# EAGLE design firestorm_1.3 (EAGLE 6.5.0)

## Sheet 1 of 2: Firestorm
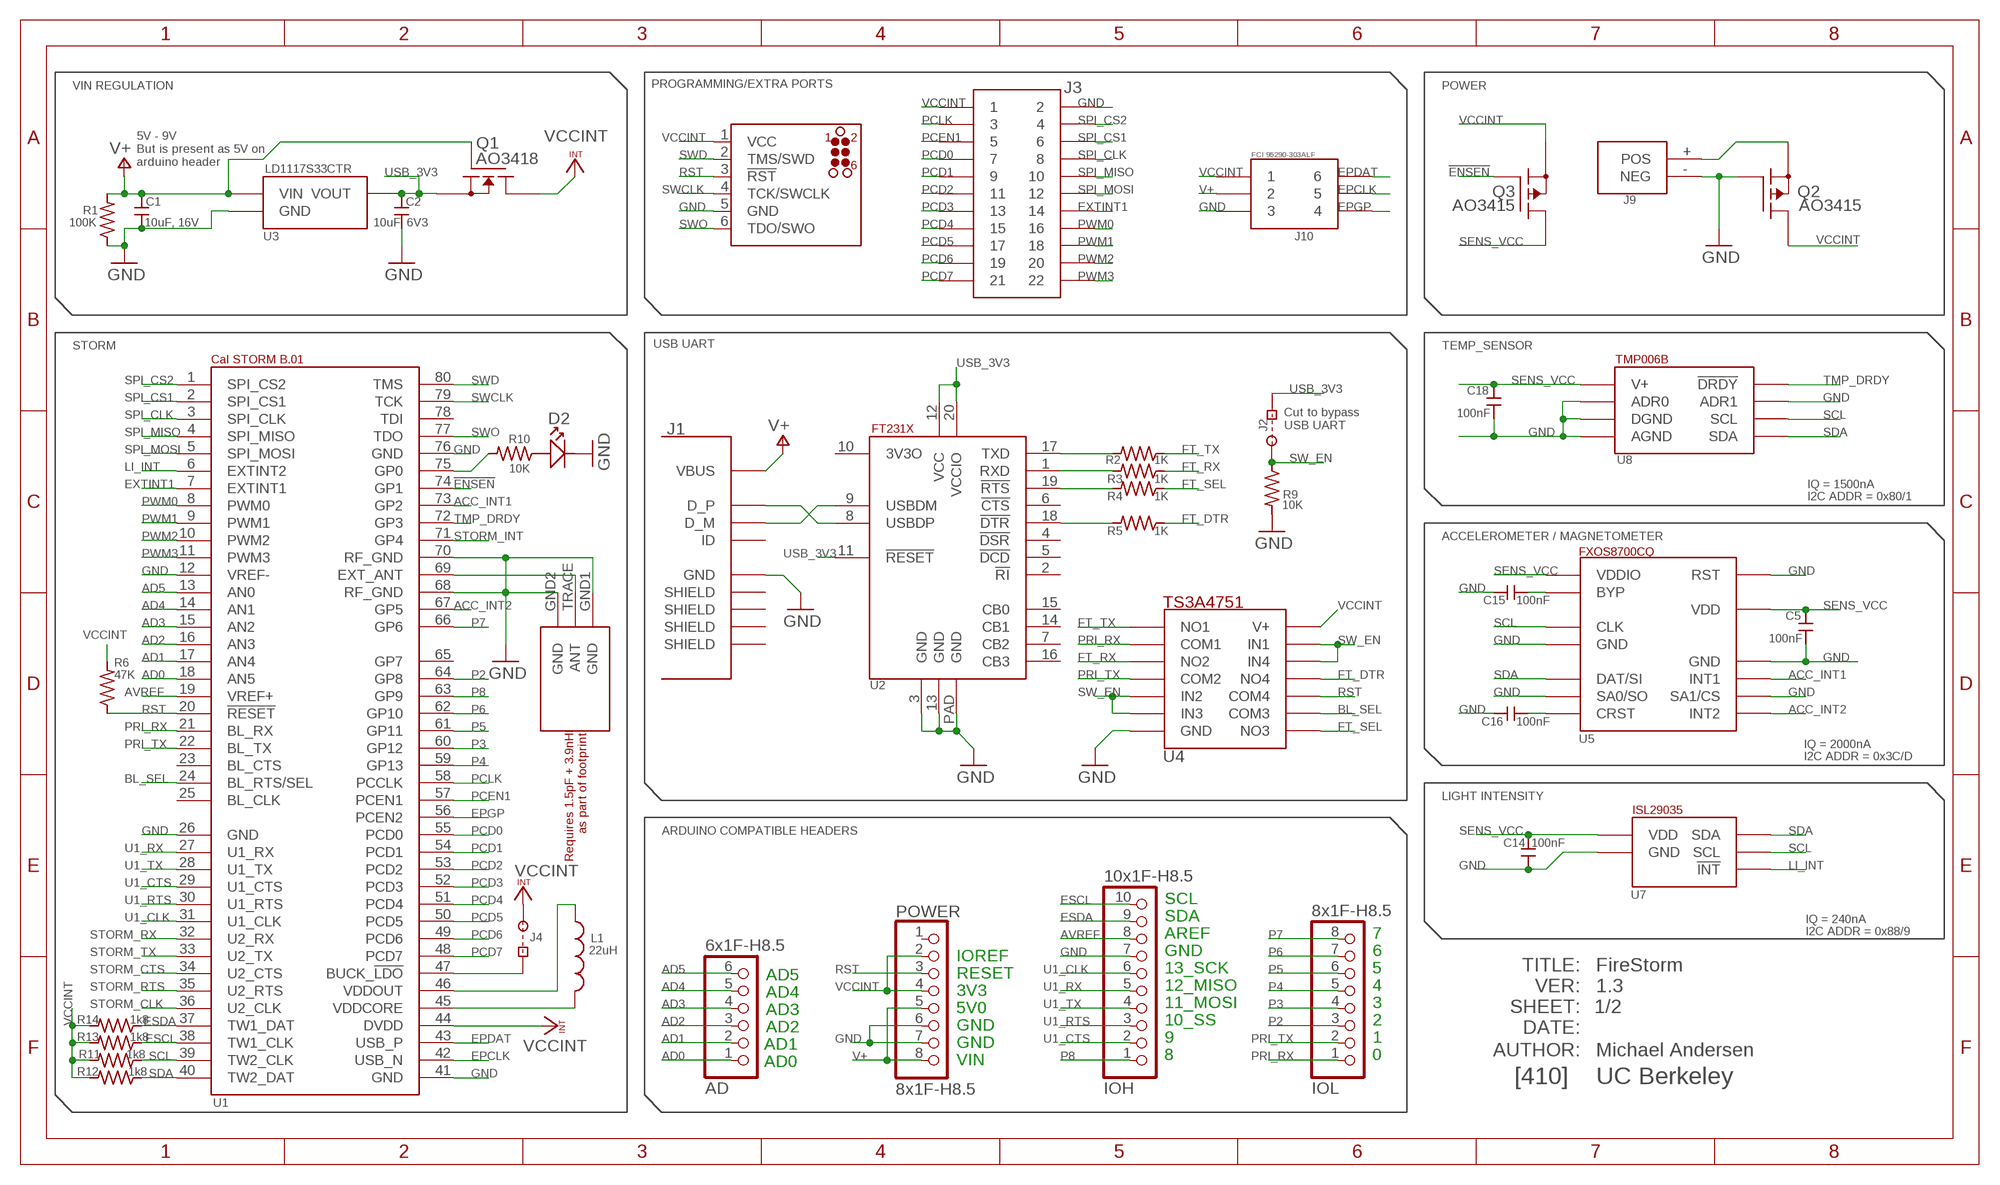
[diagram p0: schematic, sheet 1]

### Parts
AD  6x1F-H8.5  PINHD-1X6  [1X06]
C1  10uF, 16V  0805_CAPACITOR  [0805]
C2  10uF, 6V3  0603_CAPACITOR  [C0603]
C5  100nF  0603_CAPACITOR0402  [C0402]
C14  100nF  0603_CAPACITOR0402  [C0402]
C15  100nF  0603_CAPACITOR0402  [C0402]
C16  100nF  0603_CAPACITOR0402  [C0402]
C18  100nF  0603_CAPACITOR0402  [C0402]
D2  STATLED  [LINE_0805]
IOH  10x1F-H8.5  PINHD-1X10_ARD  [1X10]
IOL  8x1F-H8.5  PINHD-1X8  [1X08]
J1  USBSMT  [USB_SMT]
J2  CUTJ  [CUT]
J3  22WIDC  [22WIDC]
J4  CUTJBOT  [CUT2]
J8  JLINK_CONNECT  [TC2030-MCP-NL]
J9  BATCON  [BATCON]
J10  THRUB_POWER  [POWER_MODULE]
L1  22uH  SRN4018  [SRN4018]
POWER  8x1F-H8.5  PINHD-1X8  [1X08]
Q1  AO3418  [SOT23]
Q2  AO3415  [SOT23]
Q3  AO3415  [SOT23]
R1  100K  0603_RESISTOR0402  [C0402]
R2  1K  0603_RESISTOR0402  [C0402]
R3  1K  0603_RESISTOR0402  [C0402]
R4  1K  0603_RESISTOR0402  [C0402]
R5  1K  0603_RESISTOR0402  [C0402]
R6  47K  0603_RESISTOR0402  [C0402]
R9  10K  0603_RESISTOR0402  [C0402]
R10  10K  0603_RESISTOR0402  [C0402]
R11  1k8  0603_RESISTOR0402  [C0402]
R12  1k8  0603_RESISTOR0402  [C0402]
R13  1k8  0603_RESISTOR0402  [C0402]
R14  1k8  0603_RESISTOR0402  [C0402]
U1  STORM_B.01  [STORM_LANDING]
U2  FT231X  [QFN20L]
U3  LD1117S33CTR_3V3_REG  [SOT223]
U4  QUAD_SWITCH_TS3A4751  [TSSOP14]
U5  ACCEL_FXOS8700CQ  [TQFN16]
U7  ISL29035  [ISL29035]
U8  TMP006B  [TMP006]
U$2  JOHANSON  [JOHANSON_ANTENNA]

### Nets
!ENSEN!: Q3.1(G) U1.74(GP1)
ACC_INT1: U1.73(GP2) U5.P11(INT1)
ACC_INT2: U1.67(GP5) U5.P9(INT2)
ACCEL_BYP: C15.1 U5.P2(BYP)
AD0: AD.1 U1.18(AN5)
AD1: AD.2 U1.17(AN4)
AD2: AD.3 U1.16(AN3)
AD3: AD.4 U1.15(AN2)
AD4: AD.5 U1.14(AN1)
AD5: AD.6 U1.13(AN0)
AVREF: IOH.8 U1.19(VREF+)
BL_SEL: U1.24(BL_RTS/SEL) U4.9(COM3)
EPCLK: J10.5 U1.42(USB_N)
EPDAT: J10.6 U1.43(USB_P)
EPGP: J10.4 U1.56(PCEN2)
ESCL: IOH.10 R13.2 U1.38(TW1_CLK)
ESDA: IOH.9 R14.2 U1.37(TW1_DAT)
EXTINT1: J3.14 U1.7(EXTINT1)
FT_DTR: R5.2 U4.11(NO4)
FT_RX: R3.2 U4.3(NO2)
FT_SEL: R4.2 U4.8(NO3)
FT_TX: R2.2 U4.1(NO1)
GND: C1.1 C2.1 C5.1 C14.1 C15.2 C16.2 C18.1 D2.LINE(-) IOH.7 J1.5GND(GND) J3.2 J8.5(GND) J9.-(NEG) J10.3 POWER.6 POWER.7 Q2.1(G) R1.2 R9.1 U1.12(VREF-) U1.26(GND) U1.41(GND) U1.68(RF_GND) U1.70(RF_GND) U1.76(GND) U2.3(GND) U2.13(GND) U2.PAD(GND) U3.1(GND) U4.7(GND) U5.P5(GND) U5.P7(SA0/SO) U5.P10(SA1/CS) U5.P12(GND) U5.P16(RST) U7.2(GND) U8.A1(DGND) U8.A2(AGND) U8.B1(ADR1) U8.C1(ADR0) U$2.GND1(GND) U$2.GND2(GND) ; also sheet 2
LI_INT: U1.6(EXTINT2) U7.4(!INT!)
N$1: J1.3D+(D_P) U2.8(USBDP)
N$2: J1.2D-(D_M) U2.9(USBDM)
N$3: R2.1 U2.17(TXD)
N$4: R3.1 U2.1(RXD)
N$7: L1.P$2 U1.45(VDDCORE)
N$11: U1.69(EXT_ANT) U$2.TRACE(ANT)
N$15: C16.1 U5.P8(CRST)
N$17: R4.1 U2.19(!RTS!)
N$18: R5.1 U2.18(!DTR!)
N$20: L1.P$1 U1.46(VDDOUT)
N$21: R10.1 U1.75(GP0)
N$22: J4.SQ U1.47(BUCK_!LDO!)
N$24: D2.NOLINE(+) R10.2
N$26: J9.+(POS) Q2.2(S)
P2: IOL.3 U1.64(GP8)
P3: IOL.4 U1.60(GP12)
P4: IOL.5 U1.59(GP13)
P5: IOL.6 U1.61(GP11)
P6: IOL.7 U1.62(GP10)
P7: IOL.8 U1.66(GP6)
P8: IOH.1 U1.63(GP9)
PCD0: J3.7 U1.55(PCD0)
PCD1: J3.9 U1.54(PCD1)
PCD2: J3.11 U1.53(PCD2)
PCD3: J3.13 U1.52(PCD3)
PCD4: J3.15 U1.51(PCD4)
PCD5: J3.17 U1.50(PCD5)
PCD6: J3.19 U1.49(PCD6)
PCD7: J3.21 U1.48(PCD7)
PCEN1: J3.5 U1.57(PCEN1)
PCLK: J3.3 U1.58(PCCLK)
PRI_RX: IOL.1 U1.21(BL_RX) U4.2(COM1)
PRI_TX: IOL.2 U1.22(BL_TX) U4.4(COM2)
PWM0: J3.16 U1.8(PWM0)
PWM1: J3.18 U1.9(PWM1)
PWM2: J3.20 U1.10(PWM2)
PWM3: J3.22 U1.11(PWM3)
RST: J8.3(!RST!) POWER.3 R6.2 U1.20(!RESET!) U4.10(COM4)
SCL: R11.2 U1.39(TW2_CLK) U5.P4(CLK) U7.5(SCL) U8.B3(SCL) ; also sheet 2
SDA: R12.2 U1.40(TW2_DAT) U5.P6(DAT/SI) U7.6(SDA) U8.C3(SDA) ; also sheet 2
SENS_VCC: C5.2 C14.2 C18.2 Q3.3(D) U5.P1(VDDIO) U5.P14(VDD) U7.1(VDD) U8.A3(V+)
SPI_CLK: J3.8 U1.3(SPI_CLK)
SPI_CS1: J3.6 U1.2(SPI_CS1)
SPI_CS2: J3.4 U1.1(SPI_CS2)
SPI_MISO: J3.10 U1.4(SPI_MISO)
SPI_MOSI: J3.12 U1.5(SPI_MOSI)
STORM_CLK: U1.36(U2_CLK) ; also sheet 2
STORM_CTS: U1.34(U2_CTS) ; also sheet 2
STORM_INT: U1.71(GP4) ; also sheet 2
STORM_RTS: U1.35(U2_RTS) ; also sheet 2
STORM_RX: U1.32(U2_RX) ; also sheet 2
STORM_TX: U1.33(U2_TX) ; also sheet 2
SW_EN: J2.R R9.2 U4.5(IN2) U4.6(IN3) U4.12(IN4) U4.13(IN1)
SWCLK: J8.4(TCK/SWCLK) U1.79(TCK)
SWD: J8.2(TMS/SWD) U1.80(TMS)
SWO: J8.6(TDO/SWO) U1.77(TDO)
TMP_DRDY: U1.72(GP3) U8.C2(!DRDY!)
U1_CLK: IOH.6 U1.31(U1_CLK)
U1_CTS: IOH.2 U1.29(U1_CTS)
U1_RTS: IOH.3 U1.30(U1_RTS)
U1_RX: IOH.5 U1.27(U1_RX)
U1_TX: IOH.4 U1.28(U1_TX)
USB_3V3: C2.2 J2.SQ Q1.2(S) U2.11(!RESET!) U2.12(VCC) U2.20(VCCIO) U3.2(VOUT)
V+: C1.2 J1.1VBUS(VBUS) J10.2 POWER.5 POWER.8 Q1.1(G) R1.1 U3.3(VIN) ; also sheet 2
VCCINT: J3.1 J4.R J8.1(VCC) J10.1 POWER.2 POWER.4 Q1.3(D) Q2.3(D) Q3.2(S) R6.1 R11.1 R12.1 R13.1 R14.1 U1.44(DVDD) U4.14(V+) ; also sheet 2
Unconnected: J1.4ID(ID) J1.SHIELD@1(SHIELD) J1.SHIELD@2(SHIELD) J1.SHIELD@3(SHIELD) J1.SHIELD@4(SHIELD) POWER.1 U1.23(BL_CTS) U1.25(BL_CLK) U1.65(GP7) U1.78(TDI) U2.2(!RI!) U2.4(!DSR!) U2.5(!DCD!) U2.6(!CTS!) U2.7(CB2) U2.10(3V3O) U2.14(CB1) U2.15(CB0) U2.16(CB3)

### Notes on the sheet
- VIN REGULATION | PROGRAMMING/EXTRA PORTS | POWER
- 5V - 9V
- But is present as 5V on
  arduino header
- STORM | USB UART | TEMP_SENSOR
- Cut to bypass
  USB UART
- IQ = 1500nA
- I2C ADDR = 0x80/1
- ACCELEROMETER / MAGNETOMETER
- IQ = 2000nA
- I2C ADDR = 0x3C/D
- LIGHT INTENSITY
- ARDUINO COMPATIBLE HEADERS
- SCL
- SDA | IQ = 240nA
- AREF | 7 | I2C ADDR = 0x88/9
- GND | 6 | TITLE:
- IOREF
- 13_SCK | 5 | FireStorm
- AD5 | RESET | VER:
- 12_MISO | 4 | 1.3
- AD4 | 3V3 | SHEET:
- 11_MOSI | 3
- AD3 | 5V0
- DATE:
- 10_SS | 2
- AD2 | GND
- 9 | 1 | AUTHOR:
- AD1 | GND
- 8 | 0 | Michael Andersen
- AD0 | VIN
- [410] | UC Berkeley

## Sheet 2 of 2
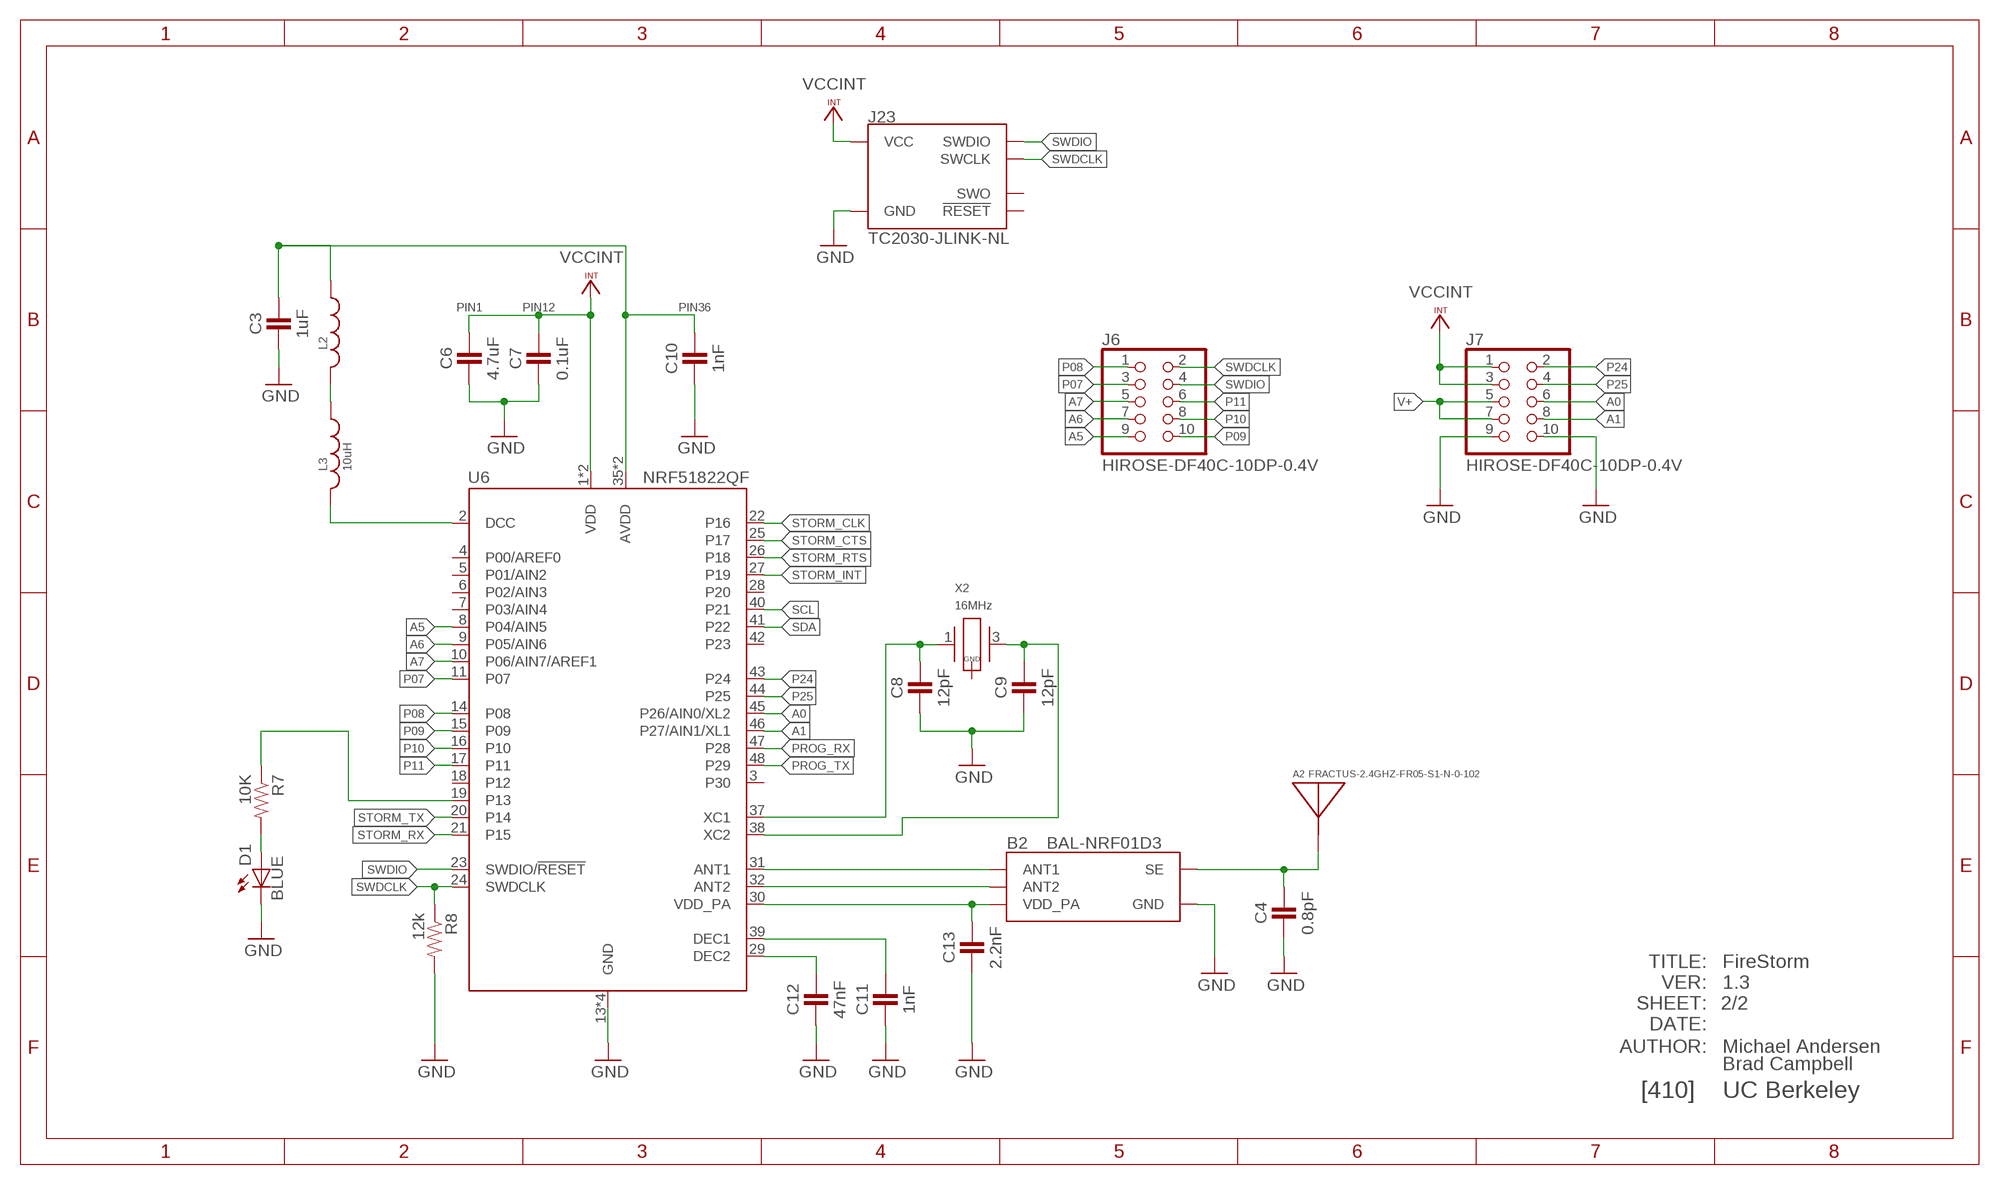
[diagram p1: schematic, sheet 2]

### Parts
A2  FRACTUS-2.4GHZ-FR05-S1-N-0-102  [FRACTUS-ANTENNA-FR05-S1-N-0-102]
B2  BAL-NRF01D3  [BAL-NRF01D3]
C3  1uF  CAPACITOR  [0402_CAP]
C4  0.8pF  CAPACITOR  [0402_CAP]
C6  4.7uF  CAPACITOR  [0402_CAP]
C7  0.1uF  CAPACITOR  [0402_CAP]
C8  12pF  CAPACITOR  [0402_CAP]
C9  12pF  CAPACITOR  [0402_CAP]
C10  1nF  CAPACITOR  [0402_CAP]
C11  1nF  CAPACITOR  [0402_CAP]
C12  47nF  CAPACITOR  [0402_CAP]
C13  2.2nF  CAPACITOR  [0402_CAP]
D1  BLUE  LED0603  [LED-0603]
J6  HIROSE-DF40C-10DP-0.4V  [2X5/SMD/0.4MM]
J7  HIROSE-DF40C-10DP-0.4V  [2X5/SMD/0.4MM]
J23  TC2030-JLINK-NL  [TC2030-IDC-NL]
L2  INDUCTOR0402  [0402_CAP]
L3  10uH  INDUCTOR0603  [0603_CAP]
R7  10K  RESISTOR  [0402_RES]
R8  12k  RESISTOR  [0402_RES]
U6  NRF51822QF  [QFN-48-6MM]
X2  16MHz  TXC-8Y  [TXC-8Y]

### Nets
A0: J7.6 U6.45(P26/AIN0/XL2)
A1: J7.8 U6.46(P27/AIN1/XL1)
A5: J6.9 U6.8(P04/AIN5)
A6: J6.7 U6.9(P05/AIN6)
A7: J6.5 U6.10(P06/AIN7/AREF1)
AVDD: C3.1 C10.1 L2.1 U6.35(AVDD) U6.36(AVDD)
DCC: L3.2 U6.2(DCC)
GND: B2.GND C3.2 C4.2 C6.2 C7.2 C8.2 C9.2 C10.2 C11.2 C12.2 C13.2 D1.C J7.9 J7.10 J23.5(GND) R8.2 U6.13(GND) U6.33(GND) U6.34(GND) U6.GND ; also sheet 1
N$5: B2.ANT1 U6.31(ANT1)
N$8: B2.ANT2 U6.32(ANT2)
N$9: A2.1(ANTENNA) B2.SE C4.1
N$10: C9.1 U6.38(XC2) X2.3
N$12: C11.1 U6.39(DEC1)
N$13: R7.1 U6.19(P13)
N$14: L2.2 L3.1
N$16: C8.1 U6.37(XC1) X2.1
N$19: C12.1 U6.29(DEC2)
N$23: D1.A R7.2
P07: J6.3 U6.11(P07)
P08: J6.1 U6.14(P08)
P09: J6.10 U6.15(P09)
P10: J6.8 U6.16(P10)
P11: J6.6 U6.17(P11)
P24: J7.2 U6.43(P24)
P25: J7.4 U6.44(P25)
PROG_RX: U6.47(P28)
PROG_TX: U6.48(P29)
SCL: U6.40(P21) ; also sheet 1
SDA: U6.41(P22) ; also sheet 1
STORM_CLK: U6.22(P16) ; also sheet 1
STORM_CTS: U6.25(P17) ; also sheet 1
STORM_INT: U6.27(P19) ; also sheet 1
STORM_RTS: U6.26(P18) ; also sheet 1
STORM_RX: U6.21(P15) ; also sheet 1
STORM_TX: U6.20(P14) ; also sheet 1
SWDCLK: J6.2 J23.4(SWCLK) R8.1 U6.24(SWDCLK)
SWDIO: J6.4 J23.2(SWDIO) U6.23(SWDIO/!RESET)
V+: J7.5 J7.7 ; also sheet 1
VCCINT: C6.1 C7.1 J7.1 J7.3 J23.1(VCC) U6.1(VDD) U6.12(VDD) ; also sheet 1
VDD_PA: B2.VCC(VDD_PA) C13.1 U6.30(VDD_PA)
Unconnected: J23.3(!RESET) J23.6(SWO) U6.3(P30) U6.4(P00/AREF0) U6.5(P01/AIN2) U6.6(P02/AIN3) U6.7(P03/AIN4) U6.18(P12) U6.28(P20) U6.42(P23) X2.2(GND) X2.4(GND)

### Notes on the sheet
- PIN1 | PIN12 | PIN36
- TITLE:
- FireStorm
- VER:
- 1.3
- SHEET:
- DATE:
- AUTHOR:
- Michael Andersen
- Brad Campbell
- [410] | UC Berkeley

## Library data of the parts
A2 = chips:FRACTUS-2.4GHZ-FR05-S1-N-0-102: Fractus Compact Reach XtendTM chip antenna is engineered specifically for Bluetooth, WLAN 802.11 b/g/n and other wireless devices operating at the ISM 2.4 GHz band. Compact Reach Xtend combines small form factor size and high performance to improve the functionality of your wireless devices.; RICHARDSON_RFPD: FR05-S1-N-0102B
AD = SmartPrj:PINHD-1X6: PIN HEADER
B2 = chips:BAL-NRF01D3: 50 ohm nominal input / conjugate match balun to nRF51422-QFAA, nRF24LE1, nRF51822-QFAA/AB, with integrated harmonic filter; DIGIKEY: 497-13637-1-ND; MOUSER: 511-BAL-NRF01D3
C1 = storm:0805_CAPACITOR
C2 C5 C14-C16 C18 = storm:0603_CAPACITOR
C3 = passives:CAPACITOR: 0402 Capacitor; DIGIKEY: 1276-1513-1-ND
C4 C13 = passives:CAPACITOR: 0402 Capacitor; DIGIKEY: 490-5419-1-ND
C6 = passives:CAPACITOR: 0402 Capacitor; DIGIKEY: 445-5947-1-ND
C7 = passives:CAPACITOR: 0402 Capacitor; DIGIKEY: 445-4952-1-ND
C8 C9 = passives:CAPACITOR: 0402 Capacitor; DIGIKEY: 490-6197-1-ND
C10 C11 = passives:CAPACITOR: 0402 Capacitor; DIGIKEY: 490-1303-1-ND
C12 = passives:CAPACITOR: 0402 Capacitor; DIGIKEY: 445-1264-1-ND
D1 = SparkFun-LED:LED: LEDs Standard schematic elements and footprints for 5mm, 3mm, 1206, and 0603 sized LEDs. 5mm - Spark Fun Electronics SKU : COM-00529 (and others)
D2 = storm:STATLED
IOH = SmartPrj:PINHD-1X10_ARD: PIN HEADER
IOL POWER = SmartPrj:PINHD-1X8: PIN HEADER
J1 = storm:USB
J2 J4 = storm:CUTJ
J3 = storm:22WIDC
J6 J7 = headers:HIROSE-DF40C-10DP-0.4V: DF40 Series Header - 0.4MM Pitch; DIGIKEY: H11616CT-ND; MOUSER: 798-DF40C10DP0.4V51; NEWARK: 68X2585
J8 = storm:JLINK_CONNECT
J9 = storm:BATCON
J10 = storm:THRUB_POWER
J23 = connector:TC2030-JLINK
L1 = storm:SRN4018
L2 = passives:INDUCTOR; DIGIKEY: 587-1521-1-ND
L3 = passives:INDUCTOR; DIGIKEY: 490-4025-1-ND
Q1 = storm:AO3418
Q2 Q3 = storm:AO3415
R1-R6 R9-R14 = storm:0603_RESISTOR
R7 = passives:RESISTOR: Resistor Basic schematic elements and footprints for 0603, 1206, and PTH resistors.; DIGIKEY: RHM470CECT-ND
R8 = passives:RESISTOR: Resistor Basic schematic elements and footprints for 0603, 1206, and PTH resistors.; DIGIKEY: RHM12.0KCDCT-ND
U1 = storm:STORM_B.01
U2 = storm:FT231X
U3 = storm:LD1117S33CTR_3V3_REG
U4 = storm:QUAD_SWITCH_TS3A4751
U5 = storm:ACCEL_FXOS8700CQ
U6 = chips:NRF51822: Multiprotocol Bluetooth® 4.0 low energy/2.4 GHz RF SoC; DIGIKEY: 1490-1032-1-ND; MOUSER: 949-NRF51822-QFAB-R7
U7 = storm:ISL29035
U8 = storm:TMP006B
U$2 = storm:JOHANSON
X2 = crystals:TXC-8Y: 2mmx1.6mm SMD Crystal; DIGIKEY: 887-2003-1-ND

## Net classes
0 default: width 0.203 mm
1 power: width 0.203 mm
2 gnd: width 0.203 mm
3 usbvcc: width 0.203 mm
4 aref: width 0.203 mm

## Board
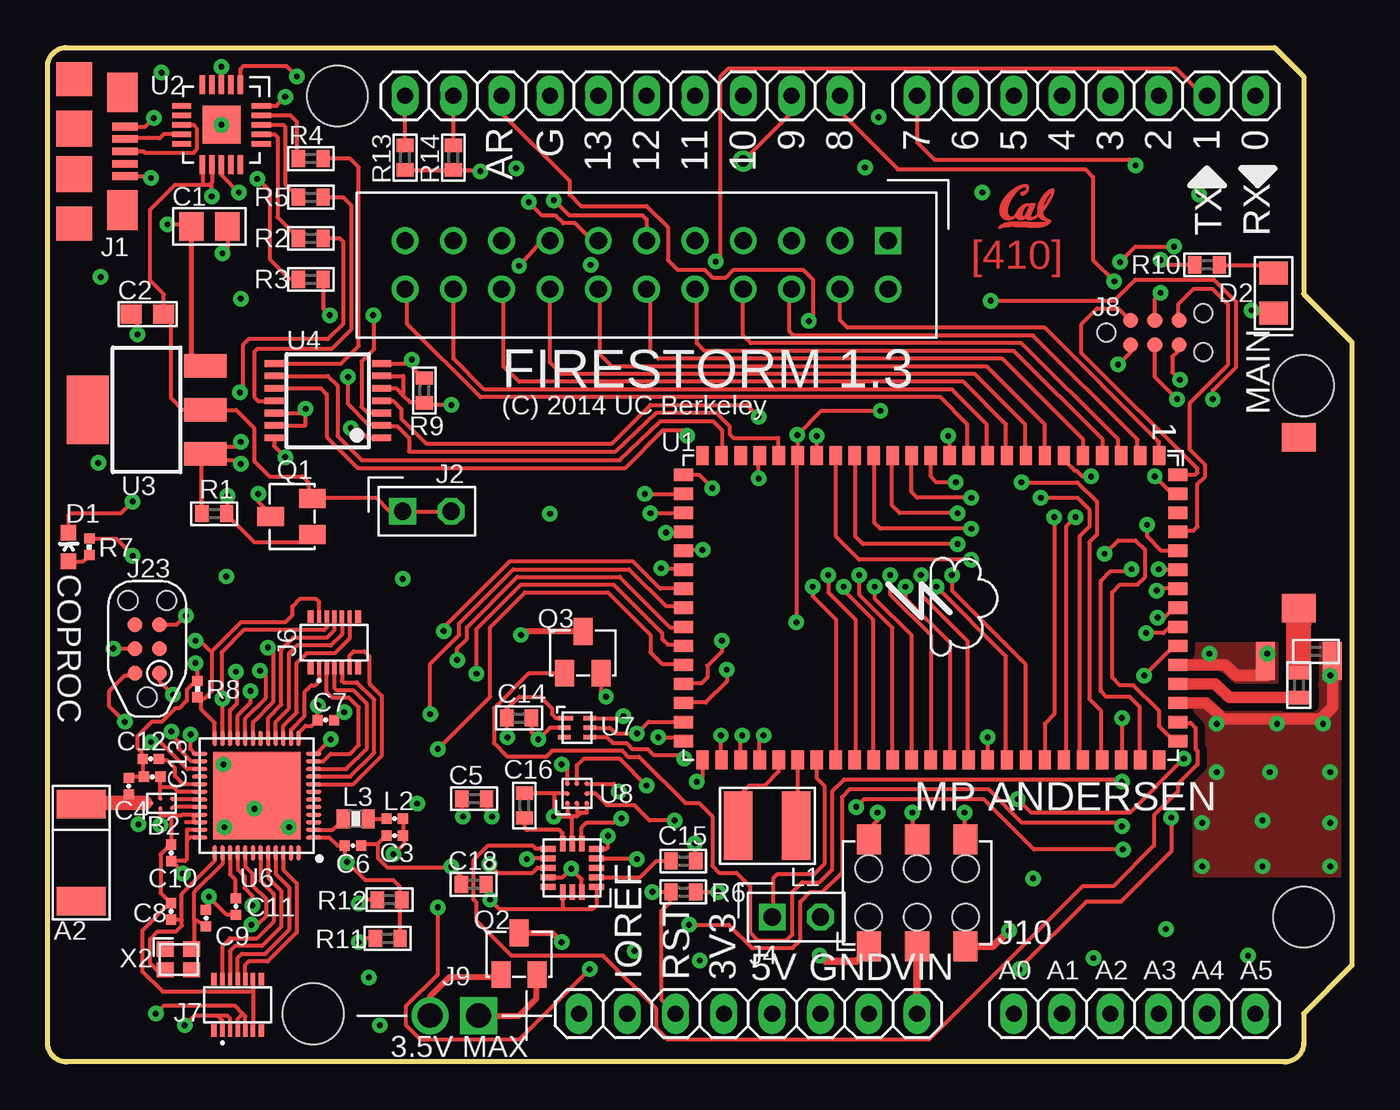
[diagram p2: board, top side]
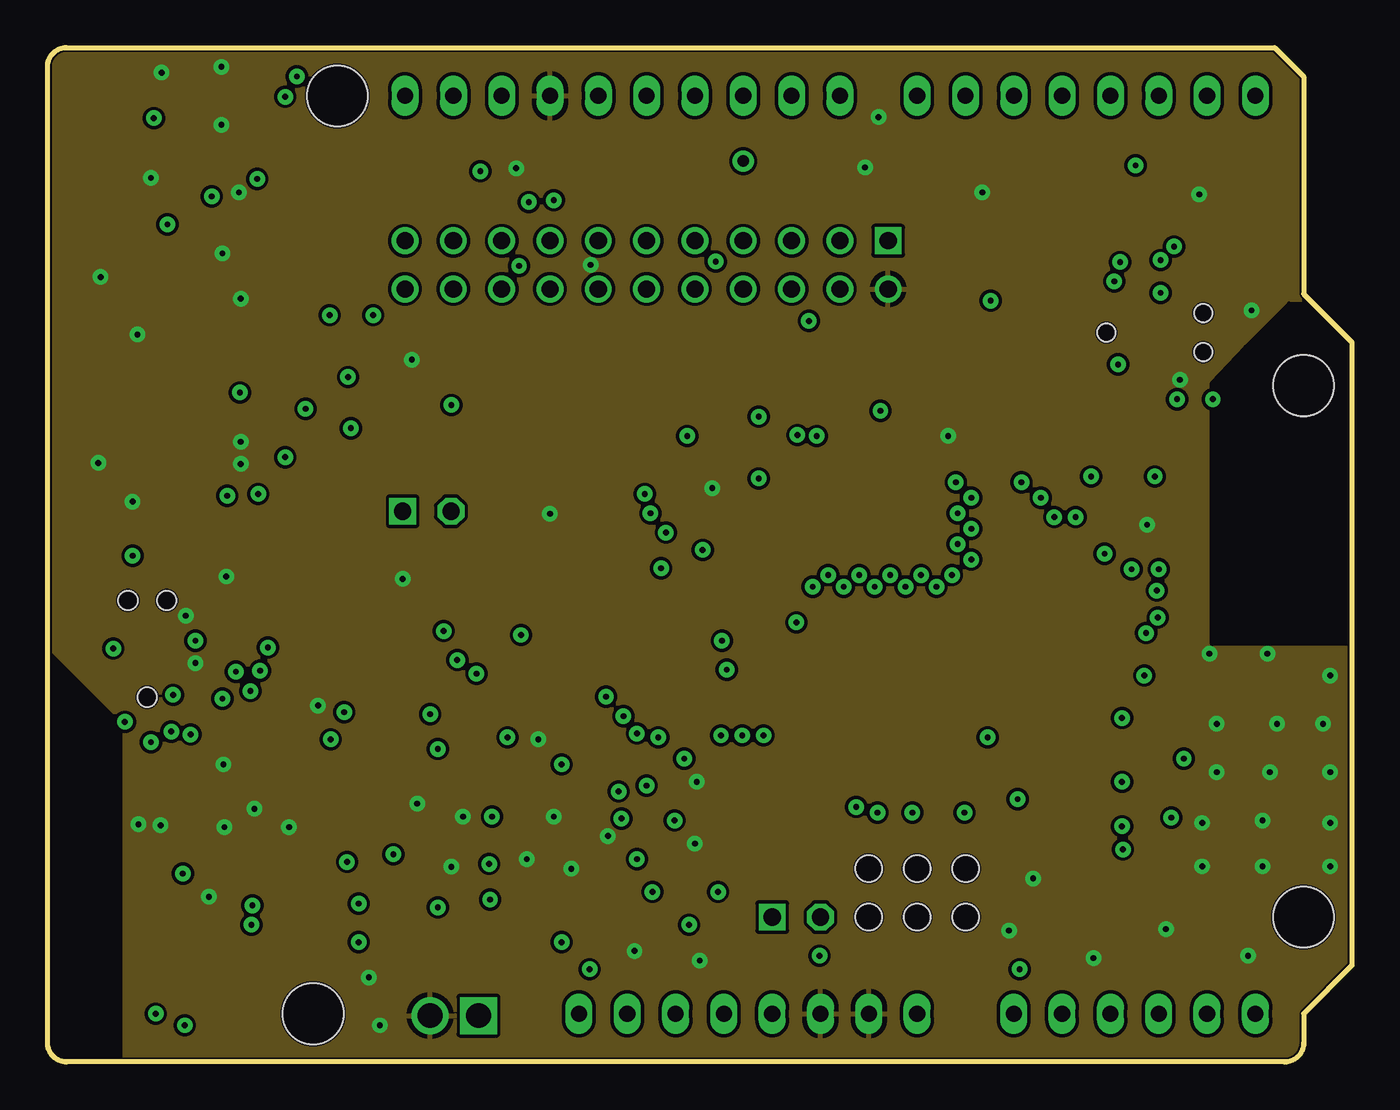
[diagram p3: board, inner layer Route2]
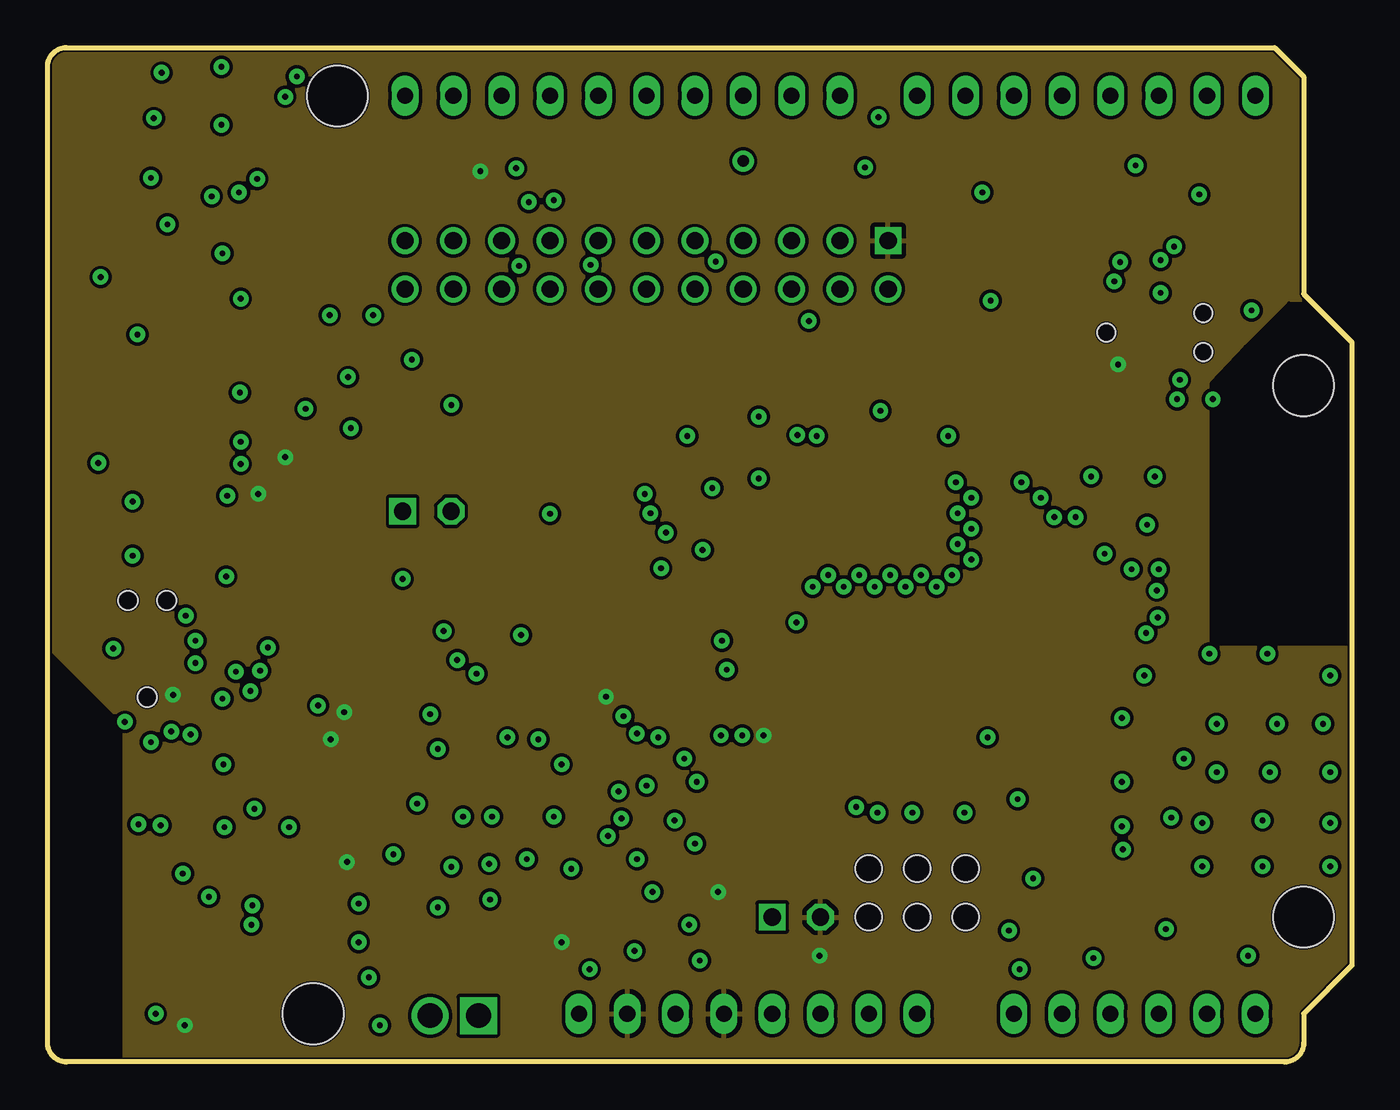
[diagram p4: board, inner layer Route15]
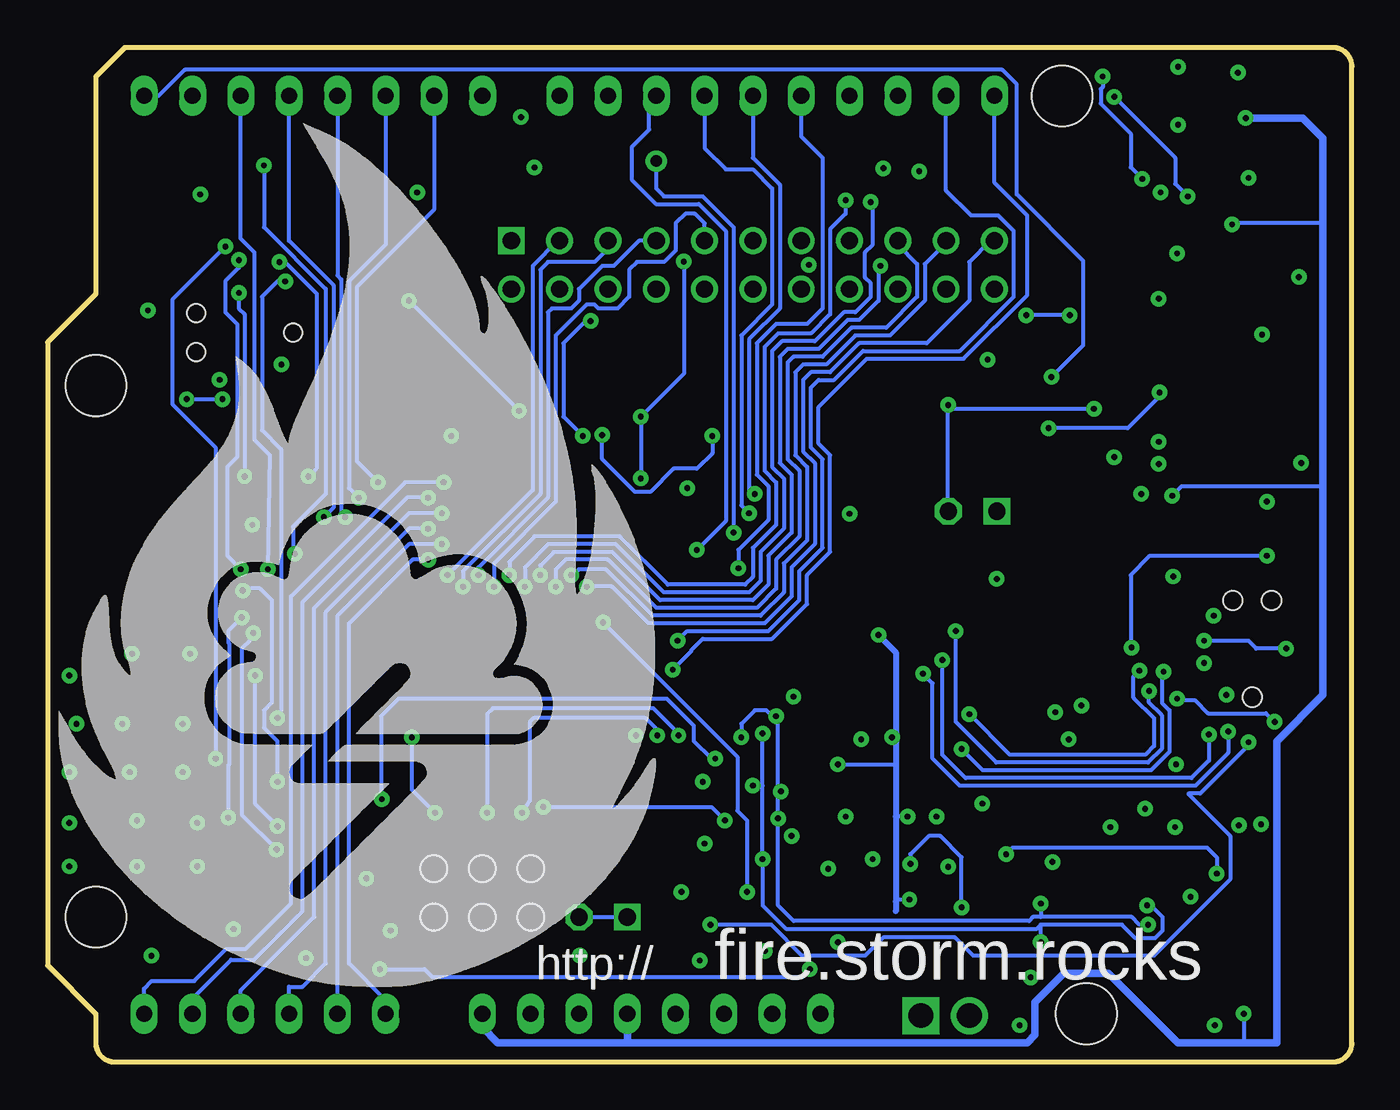
[diagram p5: board, bottom side, seen from below]

Size 68.58 x 53.34 mm. Coordinates in mm from the lower left corner, seen from the top.
Outline: 64.52,53.34 66.04,51.82 66.04,40.39 68.58,37.85 68.58,5.08 66.04,2.54 66.04,1 arc-90 65.04,0 1,0 arc-90 0,1 0,52.34 arc-90 1,53.34 64.52,53.34
Copper layers (1*2*15*16): Top 0.035mm / dielectric 1.5mm / Route2 0.035mm / dielectric 0.15mm / Route15 0.035mm / dielectric 0.2mm / Bottom 0.035mm
Design rules "default *": minimum track width 8mil, minimum drill 12mil, track to track 7mil, track to pad 7mil, pad to pad 6mil, via to via 7mil, smd to smd 0mil, copper to edge 4mil, drill to drill 8mil, minimum pad ring 10mil, minimum via ring 10mil, stop-mask expansion 1mil, vias tented up to drill 30mil, thermal gap 10mil
Holes 3.2 mm at 66.04,35.56 66.04,7.62 15.24,50.8 13.97,2.54
vRestrict: area 22.9,44.1 to 24.6,49.1; area 25.4,45.5 to 27.1,49.1; area 28.4,45.3 to 29.6,48.8; area 31,45.3 to 32.1,48.8; area 33.5,45.3 to 34.7,48.8; area 36.1,45.3 to 37.2,48.8; area 38.7,47.2 to 39.9,48.8; area 40.3,45.1 to 47.6,46.9; area 60.3,44.2 to 61.7,46.7; area 62.9,44.2 to 64.3,46.7; area 61.3,35.8 to 64.8,37.2; area 0.6,21.8 to 2,30.1; 14 more areas

### Footprints (pad centres in the part's own frame; a part is rotated, then mirrored left to right if it is on the bottom)
FRACTUS-ANTENNA-FR05-S1-N-0-102 = smd 1.5 x 2.6: 1 -2.55,0; 2 2.55,0
1X06 = drill 0.85 pad 1.422 long: 1 -6.35,0; 2 -3.81,0; 3 -1.27,0; 4 1.27,0; 5 3.81,0; 6 6.35,0
BAL-NRF01D3 = smd 0.22 x 0.22: ANT1 -0.537,-0.25; ANT2 -0.537,0.25; GND 0.069,0.25; SE 0.537,0; VCC 0.069,-0.25
0805 = smd 1.3 x 1.5: 1 -0.95,0; 2 0.95,0
C0603 = smd 1.1 x 1: 1 -0.85,0; 2 0.85,0
0402_CAP = smd 0.536 x 0.546: 1 -0.433,0; 2 0.433,0
C0402 = smd 0.7 x 0.9: 1 -0.65,0; 2 0.65,0
LED-0603 = smd 0.8 x 0.8: A 0,-0.75; C 0,0.75
LINE_0805 = smd 1.2 x 1.5: LINE 0,0; NOLINE 2.11,0
1X10 = drill 0.85 pad 1.422 long: 1 -11.43,0; 2 -8.89,0; 3 -6.35,0; 4 -3.81,0; 5 -1.27,0; 6 1.27,0; 7 3.81,0; 8 6.35,0; 9 8.89,0; 10 11.43,0
1X08 = drill 0.85 pad 1.422 long: 1 -8.89,0; 2 -6.35,0; 3 -3.81,0; 4 -1.27,0; 5 1.27,0; 6 3.81,0; 7 6.35,0; 8 8.89,0
USB_SMT = smd 0.4 x 1.35: 1VBUS -1.3,2.675; 2D- -0.65,2.675; 3D+ 0,2.675; 4ID 0.65,2.675; 5GND 1.3,2.675 | smd 2.1 x 1.6: SHIELD@1 -3.1,2.55; SHIELD@6 3.1,2.55 | smd 1.8 x 1.9: SHIELD@2 -3.8,0; SHIELD@5 3.8,0 | smd 1.9 x 1.9: SHIELD@3 -1.2,0; SHIELD@4 1.2,0
CUT = drill 0.9 octagon: R 1.27,0 | drill 0.9 square: SQ -1.27,0
22WIDC = drill 0.9 square: 1 0,2.54 | drill 0.9: 2 2.54,2.54; 3 0,0; 4 2.54,0; 5 0,-2.54; 6 2.54,-2.54; 7 0,-5.08; 8 2.54,-5.08; 9 0,-7.62; 10 2.54,-7.62; 11 0,-10.16; 12 2.54,-10.16; 13 0,-12.7; 14 2.54,-12.7; 15 0,-15.24; 16 2.54,-15.24; 17 0,-17.78; 18 2.54,-17.78; 19 0,-20.32; 20 2.54,-20.32; 21 0,-22.86; 22 2.54,-22.86
CUT2 = drill 0.9 octagon: R 1.27,0 | drill 0.9 square: SQ -1.27,0
2X5/SMD/0.4MM = smd 0.66 x 0.23: 1 -1.355,0.8; 2 1.355,0.8; 3 -1.355,0.4; 4 1.355,0.4; 5 -1.355,0; 6 1.355,0; 7 -1.355,-0.4; 8 1.355,-0.4; 9 -1.355,-0.8; 10 1.355,-0.8 | smd 0.66 x 0.3: A -1.355,1.25; B 1.355,1.25; C -1.355,-1.25; D 1.355,-1.25
TC2030-MCP-NL = smd 0.787 x 0.787: 1 1.27,-0.635; 2 1.27,0.635; 3 2.54,-0.635; 4 2.54,0.635; 5 3.81,-0.635; 6 3.81,0.635 | hole 0.95: 0,0; 5.08,-1.016; 5.08,1.016
BATCON = drill 1.3 square: + 0,0 | drill 1.3: - 0,-2.54
POWER_MODULE = smd 1.27 x 1.57: 1 -2.54,-2.815; 2 0,-2.815; 3 2.54,-2.815; 4 2.54,2.815; 5 0,2.815; 6 -2.54,2.815 | hole 1.4: -2.54,1.27; 0,1.27; 2.54,1.27; 2.54,-1.27; 0,-1.27; -2.54,-1.27
TC2030-IDC-NL = smd 0.787 x 0.787: 1 -1.27,-0.635; 2 -1.27,0.635; 3 0,-0.635; 4 0,0.635; 5 1.27,-0.635; 6 1.27,0.635 | hole 1.016: -2.54,0; 2.54,1.016; 2.54,-1.016
SRN4018 = smd 1.5 x 3.6: P$1 -1.525,0; P$2 1.525,0
0603_CAP = smd 0.7 x 1: 1 -0.65,0; 2 0.65,0
SOT23 = smd 1 x 1.4: 1 -0.95,-1.1; 2 0.95,-1.1; 3 0,1.1
0402_RES = smd 0.536 x 0.546: 1 -0.433,0; 2 0.433,0
STORM_LANDING = smd 1 x 0.65: 1 0,-1; 2 0,-2; 3 0,-3; 4 0,-4; 5 0,-5; 6 0,-6; 7 0,-7; 8 0,-8; 9 0,-9; 10 0,-10; 11 0,-11; 12 0,-12; 13 0,-13; 14 0,-14; 15 0,-15; 16 0,-16; 17 0,-17; 18 0,-18; 19 0,-19; 20 0,-20; 21 0,-21; 22 0,-22; 23 0,-23; 24 0,-24; 25 0,-25; 41 16,-25; 42 16,-24; 43 16,-23; 44 16,-22; 45 16,-21; 46 16,-20; 47 16,-19; 48 16,-18; 49 16,-17; 50 16,-16; 51 16,-15; 52 16,-14; 53 16,-13; 54 16,-12; 55 16,-11; 56 16,-10; 57 16,-9; 58 16,-8; 59 16,-7; 60 16,-6; 61 16,-5; 62 16,-4; 63 16,-3; 64 16,-2; 65 16,-1 | smd 0.65 x 1: 26 1,-26; 27 2,-26; 28 3,-26; 29 4,-26; 30 5,-26; 31 6,-26; 32 7,-26; 33 8,-26; 34 9,-26; 35 10,-26; 36 11,-26; 37 12,-26; 38 13,-26; 39 14,-26; 40 15,-26; 66 15,0; 67 14,0; 68 13,0; 69 12,0; 70 11,0; 71 10,0; 72 9,0; 73 8,0; 74 7,0; 75 6,0; 76 5,0; 77 4,0; 78 3,0; 79 2,0; 80 1,0
QFN20L = smd 1 x 0.3: 1 -2.1,1; 2 -2.1,0.5; 3 -2.1,0; 4 -2.1,-0.5; 5 -2.1,-1; 11 2.1,-1; 12 2.1,-0.5; 13 2.1,0; 14 2.1,0.5; 15 2.1,1 | smd 0.3 x 1: 6 -1,-2.1; 7 -0.5,-2.1; 8 0,-2.1; 9 0.5,-2.1; 10 1,-2.1; 16 1,2.1; 17 0.5,2.1; 18 0,2.1; 19 -0.5,2.1; 20 -1,2.1 | smd 2 x 2: PAD 0,0
SOT223 = smd 1.219 x 2.235: 1 -2.311,-3.099; 2 0,-3.099; 3 2.311,-3.099 | smd 3.6 x 2.2: 4 0,3.099
TSSOP14 = smd 0.35 x 1: 1 -1.95,-2.825; 2 -1.3,-2.825; 3 -0.65,-2.825; 4 0,-2.825; 5 0.65,-2.825; 6 1.3,-2.825; 7 1.95,-2.825; 8 1.95,2.825; 9 1.3,2.825; 10 0.65,2.825; 11 0,2.825; 12 -0.65,2.825; 13 -1.3,2.825; 14 -1.95,2.825
TQFN16 = smd 0.8 x 0.3: P1 -1.275,1; P2 -1.275,0.5; P3 -1.275,0; P4 -1.275,-0.5; P5 -1.275,-1; P9 1.275,-1; P10 1.275,-0.5; P11 1.275,0; P12 1.275,0.5; P13 1.275,1 | smd 0.3 x 0.8: P6 -0.5,-1.275; P7 0,-1.275; P8 0.5,-1.275; P14 0.5,1.275; P15 0,1.275; P16 -0.5,1.275
QFN-48-6MM = smd 0.8 x 0.203: 1 -3,2.2; 2 -3,1.8; 3 -3,1.4; 4 -3,1; 5 -3,0.6; 6 -3,0.2; 7 -3,-0.2; 8 -3,-0.6; 9 -3,-1; 10 -3,-1.4; 11 -3,-1.8; 12 -3,-2.2; 25 3,-2.2; 26 3,-1.8; 27 3,-1.4; 28 3,-1; 29 3,-0.6; 30 3,-0.2; 31 3,0.2; 32 3,0.6; 33 3,1; 34 3,1.4; 35 3,1.8; 36 3,2.2 | smd 0.203 x 0.8: 13 -2.2,-3; 14 -1.8,-3; 15 -1.4,-3; 16 -1,-3; 17 -0.6,-3; 18 -0.2,-3; 19 0.2,-3; 20 0.6,-3; 21 1,-3; 22 1.4,-3; 23 1.8,-3; 24 2.2,-3; 37 2.2,3; 38 1.8,3; 39 1.4,3; 40 1,3; 41 0.6,3; 42 0.2,3; 43 -0.2,3; 44 -0.6,3; 45 -1,3; 46 -1.4,3; 47 -1.8,3; 48 -2.2,3 | smd 4.6 x 4.6: GND 0,0
ISL29035 = smd 0.8 x 0.25: 1 -0.6,0.5 | smd 0.65 x 0.25: 2 -0.675,0; 3 -0.675,-0.5; 4 0.675,-0.5; 5 0.675,0; 6 0.675,0.5
TMP006 = smd 0.25 x 0.25: A1 -0.5,-0.5; A2 -0.5,0; A3 -0.5,0.5; B1 0,-0.5; B3 0,0.5; C1 0.5,-0.5; C2 0.5,0; C3 0.5,0.5
JOHANSON_ANTENNA = smd 2 x 1: GND1 -1,1.76; GND2 -1,-1.76 | smd 1.5 x 1.8: IGNORE2 1.75,0; IGNORE3 10.75,0 | smd 0.7 x 1.32: TRACE -2.938,0; TRACE1 -1.638,0
TXC-8Y = smd 0.9 x 0.8: 1 -0.7,-0.55; 2 0.7,-0.55; 3 0.7,0.55; 4 -0.7,0.55

### Placement (x,y rotation side)
A2  1.77,11.01 270 top
AD  57.15,2.54 0 top
B2  6,13.6 180 top
C1  8.51,43.94 180 top
C2  5.26,39.32 0 top
C3  18.25,11.9 180 top
C4  4.27,14.5 90 top
C5  22.43,13.84 0 top
C6  16.05,11.38 0 top
C7  14.63,17.98 180 top
C8  6.5,7.92 90 top
C9  8.33,7.57 90 top
C10  6.5,11 90 top
C11  9.91,8.18 270 top
C12  5.43,15.94 180 top
C13  5.5,15 180 top
C14  24.79,18.08 180 top
C15  33.43,10.57 0 top
C16  25.07,13.49 90 top
C18  22.4,9.35 0 top
D1  1.1,27.07 0 top
D2  64.47,39.37 90 top
IOH  30.23,50.8 180 top
IOL  54.61,50.8 180 top
J1  1.4,47.88 270 top
J2  19.94,28.96 0 top
J3  41.66,43.18 270 top
J4  39.37,7.62 0 top
J6  15.08,22.05 90 top
J7  10,3 90 top
J8  55.68,38.35 0 top
J9  22.66,2.44 270 top
J10  45.72,8.89 0 top
J23  5.24,21.72 90 top
L1  37.85,12.42 180 top
L2  18.25,12.8 180 top
L3  16.2,12.79 180 top
POWER  36.83,2.54 0 top
Q1  12.83,28.68 90 top
Q2  24.79,5.69 0 top
Q3  28.14,21.54 0 top
R1  8.76,28.83 180 top
R2  13.84,43.31 0 top
R3  13.84,41.15 0 top
R4  13.84,47.5 0 top
R5  13.84,45.47 0 top
R6  33.43,8.94 180 top
R7  2.2,27.09 270 top
R8  7.89,19.61 90 top
R9  19.81,35.31 270 top
R10  60.96,41.91 0 top
R11  17.88,6.5 180 top
R12  17.98,8.53 180 top
R13  18.8,47.55 90 top
R14  21.34,47.55 90 top
U1  59.44,31.88 270 top
U2  9.14,49.28 270 top
U3  5.21,34.29 90 top
U4  14.73,34.77 90 top
U5  27.58,10.21 180 top
U6  11,14 180 top
U7  27.84,17.58 0 top
U8  27.84,14.12 0 top
U$1  [BEAR]  49.96,43.79 0 top
U$2  65.79,22.1 90 top
X2  6.88,5.39 0 top

### Tracks (layer width: path | path; a pad name or v marks a point on that pad's centre or on a via)
!ENSEN!  (via drill 0.3)
  Top 0.203: U1.74 59.44,24.79 59.33,24.89 58.42,24.89 v58.32,24.79 | Q3.1 27.13,20.42 25.3,20.42 23.47,18.59 23.47,16.76 24.18,16.05 26.21,16.05 26.52,16.36 30.23,16.36 30.53,16.05 31.09,16.05 33.53,13.61 34.24,13.61 34.95,12.9 34.95,10.31 35.31,9.96 36.22,9.96 36.93,9.25 36.93,6.81 37.34,6.4 38.86,6.4 39.17,6.71 39.17,8.94 39.67,9.45 40.59,9.45 41.25,10.11 41.25,14.22 41.86,14.83 56.08,14.83 56.18,14.73 v56.49,14.73
  Bottom 0.203: v56.49,14.73 56.49,16.87 57.2,17.58 57.2,18.49 56.79,18.9 56.79,24.28 57.4,24.89 58.22,24.89 v58.32,24.79
A0
  Top 0.203: U6.45 12,9.9 12.7,9.2 12.7,6.96 11.43,5.69 10.21,5.69 10,5.48 J7.6
A1
  Top 0.203: U6.46 12.4,10.11 13.11,9.4 13.11,6.81 11.58,5.28 10.57,5.28 10.4,5.12 J7.8
A5
  Top 0.203: J6.9 15.88,21.37 16.1,21.59 16.66,21.59 16.92,21.34 16.92,19.91 17.58,19.25 17.58,16.1 16.08,14.61 U6.8
A6
  Top 0.203: U6.9 15.92,15 17.17,16.26 17.17,19.05 16.26,19.96 15.55,19.96 15.48,20.03 J6.7
A7
  Top 0.203: J6.5 15.08,19.67 15.19,19.56 16.05,19.56 16.76,18.85 16.76,16.46 15.71,15.4 U6.10
ACC_INT1  (via drill 0.3)
  Top 0.203: U5.P11 25.76,10.21 25.5,9.96 23.67,9.96 v23.22,10.41 | v20.52,8.13 20.52,4.62 18.85,2.95 18.85,1.93 19.61,1.17 24.79,1.17 v28.5,4.88 | v59.08,12.85 59.08,11.07 56.44,8.43 54.61,8.43 51.16,4.98 v51.1,4.88 | v58.37,23.37 58.73,23.37 59.23,23.88 U1.73
  Bottom 0.203: v23.22,10.41 23.22,10.92 22.25,11.89 21.64,11.89 20.52,10.77 v20.52,8.13 | v59.08,12.85 59.08,15.6 59.03,15.65 59.03,22 59.08,22.05 59.08,22.66 v58.37,23.37 | v51.1,4.88 48.77,4.88 48.36,4.47 28.91,4.47 v28.5,4.88
ACC_INT2
  Top 0.203: U5.P9 26.26,11.23 25.65,11.23 25.5,11.38 23.16,11.38 22.4,10.62 22.4,8.53 22.55,8.38 22.55,7.42 24.38,5.59 29.21,5.59 32,2.79 32,1.78 32.61,1.17 46.33,1.17 54.41,9.25 56.03,9.25 58.17,11.38 58.17,12.95 59.44,14.22 59.44,14.63 60.45,15.65 60.45,16.36 60.35,16.46 60.35,17.58 60.1,17.83 59.44,17.83 U1.67
ACCEL_BYP
  Top 0.203: U5.P2 31.15,9.71 32,10.57 C15.1
AD0  (via drill 0.3)
  Top 0.203: v48.56,26.42 42.67,26.42 41.45,27.64 41.45,31.86 U1.18
  Bottom 0.203: AD.1 50.8,3.25 52.73,5.18 52.73,23.06 49.38,26.42 v48.56,26.42
AD1  (via drill 0.3)
  Top 0.203: U1.17 42.47,31.84 42.47,27.64 42.88,27.23 v47.85,27.23
  Bottom 0.203: AD.2 53.34,23.47 49.58,27.23 v47.85,27.23
AD2  (via drill 0.3)
  Top 0.203: U1.16 43.48,31.83 43.48,28.35 43.79,28.04 v48.56,28.04
  Bottom 0.203: AD.3 55.88,3.96 55.17,3.96 53.95,5.18 53.95,23.67 49.58,28.04 v48.56,28.04
AD3  (via drill 0.3)
  Top 0.203: U1.15 44.4,31.84 44.4,29.26 44.81,28.85 v47.85,28.85
  Bottom 0.203: AD.4 58.42,3.76 54.56,7.62 54.56,23.88 49.58,28.85 v47.85,28.85
AD4  (via drill 0.3)
  Top 0.203: U1.14 45.41,31.86 45.41,29.97 45.72,29.67 v48.56,29.67
  Bottom 0.203: AD.5 60.96,3.35 58.93,5.39 57.71,5.39 55.17,7.92 55.17,24.18 49.68,29.67 v48.56,29.67
AD5  (via drill 0.3)
  Top 0.203: U1.13 46.43,30.79 46.74,30.48 v47.75,30.48
  Bottom 0.203: AD.6 63.5,3.86 63.09,4.27 60.86,4.27 59.18,5.94 58.17,5.94 55.78,8.33 55.78,24.49 49.78,30.48 v47.75,30.48
AVDD  (via drill 0.3)
  Top 0.203: U6.36 7.49,11.8 7.32,11.63 | 7.32,11.63 7.32,10.67 7.21,10.57 6.55,10.57 | 6.55,10.57 C10.1 | U6.35 7.33,12.2 7.32,12.19 7.32,11.63 | L2.1 18.68,11.95 18.69,11.94 | v18.19,10.92 18.75,11.48 18.75,11.89 18.69,11.94 | v7.11,9.91 6.66,10.46 6.55,10.57 | 18.69,11.94 C3.1
  Bottom 0.203: v18.19,10.92 17.83,11.28 7.62,11.28 7.11,10.77 v7.11,9.91
AVREF  (via drill 0.3)
  Top 0.203: IOH.8 23.88,49.89 27.43,46.33 27.43,45.62 28.04,45.01 31.5,45.01 32.61,43.89 32.61,42.16 33.12,41.66 34.54,41.66 34.95,41.25 35.66,41.25 36.07,41.66 39.73,41.66 40.23,41.15 40.23,39.17 v40.03,38.96 40.23,39.01 | v40.44,32.92 U1.19
  Bottom 0.203: v40.44,32.92 41.45,33.93 41.45,37.8 40.23,39.01 v40.03,38.96
BL_SEL
  Top 0.203: U4.9 14.73,36.07 15.24,35.56 15.24,32.92 16.51,31.65 30.07,31.65 32.21,33.68 35,33.68 35.46,33.22 35.46,31.9 U1.24
DCC
  Top 0.203: U6.2 15,12.2 15.29,12.5 15.29,12.53 L3.2
EPCLK  (via drill 0.3)
  Top 0.203: U1.42 35.44,16.08 35.41,16.05 v35.41,17.17 | v45.47,13.11 45.47,11.96 J10.5
  Bottom 0.203: v35.41,17.17 35.51,17.37 36.73,18.59 45.16,18.59 45.47,18.29 v45.47,13.11
EPDAT  (via drill 0.3)
  Top 0.203: U1.43 36.44,17.06 v36.52,17.17 | v43.64,13.11 43.64,12.7 43.43,12.5 43.43,11.96 J10.6
  Bottom 0.203: v36.52,17.17 36.42,17.37 37.13,18.08 43.03,18.08 43.23,17.88 43.23,13.72 v43.64,13.11
EPGP  (via drill 0.3)
  Top 0.203: U1.56 49.44,16.96 49.43,16.97 v49.43,17.07 | v48.21,13.11 48.21,11.76 J10.4
  Bottom 0.203: v49.43,17.07 49.43,14.33 v48.21,13.11
ESCL  (via drill 0.3)
  Top 0.203: R13.2 IOH.10 | v35.71,20.62 35.71,20.02 34.59,18.9 33.46,18.9 U1.38
  Bottom 0.203: IOH.10 18.8,46.23 17.07,44.5 17.07,40.34 20.42,36.98 25.5,36.98 28.04,34.44 28.04,32.51 27.43,31.9 27.43,26.82 28.65,25.6 28.65,24.08 30.48,22.25 34.14,22.25 34.75,21.64 34.75,21.59 v35.71,20.62
ESDA  (via drill 0.3)
  Top 0.203: R14.2 IOH.9 | v35.46,22.15 35.46,21.59 34.7,20.83 34.7,20.22 34.39,19.91 33.47,19.91 U1.37
  Bottom 0.203: v35.46,22.15 34.95,22.66 30.68,22.66 29.06,24.28 29.06,25.81 27.84,27.03 27.84,31.7 28.45,32.31 28.45,35.46 28.04,35.87 27.23,35.87 25.7,37.39 20.62,37.39 17.78,40.23 17.78,43.69 18.59,44.5 20.02,44.5 21.34,45.82 IOH.9
EXTINT1
  Top 0.203: U1.7 52.44,32.3 52.43,32.31 52.43,33.53 49.38,36.58 29.67,36.58 29.06,37.19 29.06,40.54 J3.14
FT_DTR
  Top 0.203: R5.2 15.55,45.47 15.95,45.06 15.95,38.51 14.93,37.49 11.02,37.49 10.87,37.34 10.87,34.95 11.07,34.75 11.88,34.75 U4.11
FT_RX  (via drill 0.3)
  Top 0.203: R3.2 14.49,39.61 v14.83,39.27 | U4.3 17.54,34.14 16.82,34.14 16.51,34.44 16.51,36.83 17.17,37.49 17.17,39.17 17.07,39.27 v17.12,39.27
  Bottom 0.203: v14.83,39.27 v17.12,39.27
FT_SEL
  Top 0.203: U4.8 15.44,36.72 16.36,37.64 16.36,47.04 15.9,47.5 R4.2
FT_TX  (via drill 0.3)
  Top 0.203: R2.2 15.37,43.31 15.55,43.13 15.55,38.81 14.73,38 10.57,38 10.26,37.69 10.26,35.36 v10.11,35.2 | v15.95,33.33 16.31,33.33 16.82,32.82 U4.1
  Bottom 0.203: v15.95,33.33 11.79,33.33 10.11,35 v10.11,35.2
GND  (via drill 0.3)
  Top 0.203: B2.GND 5.93,12.95 | 5.93,12.95 v5.93,12.46 v5.94,12.45 | v14.22,18.74 14.2,18.92 C7.2 13.89,17.68 13.56,17.68 13.2,17.31 U6.13 | D1.C 1.1,28.74 1.22,28.85 3.86,28.85 v4.47,29.46 | J23.5 6.79,22.99 v7.26,23.47 | v7.77,20.98 7.89,20.86 R8.2 7.82,20.07 7.32,19.56 7.32,19 6.91,18.59 6.71,18.59 5.99,17.88 5.49,17.88 4.72,17.12 4.72,16.51 4.93,16.31 4.93,16 C12.2 5.03,15.9 5.03,15.09 C13.2 4.34,15 C4.2 | U3.1 8.81,31.98 9.2,32.36 9.91,32.36 v10.16,32.61 | U3.1 8.97,31.98 9.3,31.65 9.96,31.65 v10.16,31.44 | C2.1 4.41,39.28 4.72,38.96 v4.72,38.25 | 7.27,12.61 U6.34 7.67,12.7 7.67,12.9 U6.33 7.06,13 7.01,12.95 6.5,12.95 | U6.GND 11,13.44 v10.87,13.31 | C1.1 9.46,42.78 v9.2,42.52 | U2.3 v9.14,52.32 | U4.7 18.94,36.72 v19.15,36.93 19.2,36.88 19.2,36.53 19.77,35.96 R9.1 | J1.5GND 5.34,46.58 v5.44,46.48 | R1.2 8.11,31.79 U3.1 | U2.13 9.14,46.63 v10.06,45.72 | 27.33,12.9 27.53,12.9 | 26.62,14.12 v26.62,12.9 27.33,12.9 | U5.P7 27.58,12.85 27.53,12.9 | U5.P10 25.24,10.71 v25.2,10.67 | U5.P5 29.4,11.21 29.46,11.28 v29.46,11.89 | C18.1 21.75,9.74 v21.23,10.26 21.18,10.21 17.88,10.21 17.37,10.72 17.37,11.38 17.32,11.43 | U5.P16 28.08,9.61 v27.53,10.16 27.08,9.71 U5.P12 | U7.2 26.42,17.58 v25.81,16.97 25.44,17.33 C14.1 | U1.26 34.25,30.88 v34.95,30.18 | U1.12 47.44,32.83 v47.35,32.92 | U1.76 58.57,26.88 57.81,27.64 v57.81,28.25 | U1.41 34.44,15.03 v34.14,14.73 | J8.5 59.36,37.72 59.36,37.31 59.13,37.08 59.13,36.27 v59.54,35.87 | D2.LINE 63.45,39.37 v63.3,39.52 | C15.2 34.08,11.44 v34.04,11.48 | 26.62,14.12 25.09,14.12 C16.2 | C5.1 21.78,12.97 v21.84,12.9 | 10.82,3.71 10.82,4.32 J7.10 | 10.82,3.71 10.82,1.68 J7.9
  Top 0.203: 10.82,3.71 6.05,3.71 4.98,4.77 4.98,6.91 6.4,8.33 C8.2 6.45,8.38 5.94,8.89 5.94,10.92 6.45,11.43 C10.2 6.5,11.53 6.5,12.95 | 17.32,11.43 16.51,11.43 C6.2 | 17.32,11.43 17.78,11.89 C3.2 | C9.2 8.38,8.03 8.38,8.58 v8.48,8.69 9.43,7.74 C11.2 | 23.67,4.47 23.77,4.47 Q2.1 | 5.93,12.95 6.5,12.95 | U8.A2 26.62,14.12 | U8.A1 27.34,12.91 27.33,12.9 | U8.B1 27.84,12.9 | 27.84,12.9 27.53,12.9 | U8.C1 28.34,13.11 28.35,13.11 28.04,13.11 27.84,12.9
  Top 0.305: 23.88,4.57 23.86,4.57 Q2.1 | J9.- 20.12,3.45 21.13,4.47 23.67,4.47 23.88,4.67
  Top 0.406: J10.3 49.71,6.08 v50.55,6.91
  Top 0.61: U1.70 61.93,20.88 62.48,20.32 64.13,20.32 64.13,20.99 U$2.GND1 | U1.68 60.88,18.88 61.85,18.03 66.93,18.03 67.56,18.67 67.56,21.08 U$2.GND2
  other vias: 9.25,15.65 12.7,12.34 9.3,12.34 9.14,49.28 17.48,1.93 4.78,12.5 5.99,52.02 60.55,45.62 43.69,49.68 28.55,41.91 42.98,47.04 61.09,21.46 64.13,21.46 67.44,20.32 67.06,17.78 64.64,17.78 61.47,17.78 61.47,15.24 60.71,12.57 60.71,10.29 67.44,10.29 63.88,10.29 67.44,12.57 67.44,15.24 63.88,12.7 64.26,15.24 63.12,5.59 58.8,6.99 54.99,5.46 51.82,9.65 34.29,5.33 30.86,5.84 16.89,4.44 19.43,13.59 18.67,25.4 26.42,28.83 9.4,25.53 2.67,31.5 10.16,40.13 2.79,41.28 24.64,46.99 49.15,45.72
  pour Route2: -4.67,55.63 71.07,55.63 71.07,-3 -4.67,-3
  pour Top (isolate 0.406): 60.32,21.97 67.94,21.97 67.94,9.78 60.32,9.78
LI_INT  (via drill 0.3)
  Top 0.203: v51,13.82 51.71,13.11 56.9,13.11 v59.74,15.95 | v59.23,42.88 57.2,42.88 v56.39,42.06 | v54.86,30.79 54.41,30.79 54.1,31.09 54,31.09 53.44,31.65 53.44,31.85 U1.6 | U7.4 28.55,17.07 29.41,17.07 29.72,16.76 30.43,16.76 30.73,16.46 31.55,16.46 31.85,16.15 33.27,16.15 v33.48,15.95
  Bottom 0.203: v59.74,15.95 59.74,32.31 62.03,34.6 62.03,40.08 v59.23,42.88 | v56.39,42.06 56.08,42.06 54.41,40.39 54.41,31.24 v54.86,30.79 | v33.48,15.95 33.68,15.95 34.59,16.87 34.59,17.68 36.02,19.1 50.14,19.1 51.05,18.19 51.05,13.87 v51,13.82
N$1
  Top 0.203: U2.8 7.67,49.28 7.85,49.07 7.85,48.01 7.67,47.8 5.13,47.8 5.05,47.88 J1.3D+
N$2
  Top 0.203: U2.9 6.1,48.78 5.89,48.57 4.11,48.57 J1.2D-
N$3
  Top 0.203: U2.17 11.93,48.78 12.09,48.62 12.09,44.41 R2.1
N$4  (via drill 0.3)
  Top 0.203: U2.1 10.14,52.21 10.31,52.38 12.55,52.38 v13.11,51.82 | v11.02,46.43 11.07,46.43 11.68,45.82 11.68,42.22 12.7,41.2 13.14,41.2 R3.1
  Bottom 0.203: v13.11,51.82 13.11,51.26 13.21,51.16 13.21,50.39 11.63,48.82 11.63,47.04 v11.02,46.43
N$5
  Top 0.203: U6.31 6.58,13.8 B2.ANT1
N$7
  Top 0.203: 36.78,12.88 36.74,12.84 | 36.74,12.84 L1.P$2 | U1.45 38.44,15.27 37.69,14.53 36.88,14.53 36.47,14.12 36.47,13.11 36.74,12.84
N$8
  Top 0.203: U6.32 6.59,13.4 B2.ANT2
N$9
  Top 0.203: B2.SE 4.99,13.6 5.13,13.61 | C4.1 4.27,13.92 4.72,13.61
  Top 0.762: 5.13,13.61 4.72,13.61 1.83,13.61 A2.1
N$10
  Top 0.203: 7.72,7.47 7.72,8.94 9.2,10.42 U6.38 | C9.1 7.75,7.49 7.72,7.47 | 7.72,7.47 7.72,6.08 X2.3
N$11
  Top 0.61: U$2.TRACE 62.12,19.16 61.53,19.75 61.47,19.81 61.4,19.88 U1.69
N$12
  Top 0.203: C11.1 9.86,8.66 9.86,9.6 9.6,9.86 U6.39
N$13  (via drill 0.3)
  Top 0.203: U6.19 10.8,17.86 11.89,18.95 11.89,21.79 v11.58,21.79 | R7.1 3.62,27.52 4.47,26.67 v4.47,26.62
  Bottom 0.203: v4.47,26.62 10.62,26.62 11.63,25.6 11.63,21.84 v11.58,21.79
N$14
  Top 0.203: L3.1 17.81,12.79 L2.2
N$15
  Top 0.203: U5.P8 27.08,12.03 26.92,12.19 25.2,12.19 25.09,12.29 25.09,12.81 C16.1
N$16
  Top 0.203: X2.1 5.73,4.84 5.39,5.18 5.39,6.45 5.79,6.86 6.76,6.86 7.06,7.16 7.06,7.47 | 7.06,7.47 7.06,8.84 8.8,10.58 U6.37 | C8.1 7.04,7.49 7.06,7.47
N$17
  Top 0.203: U2.19 12.76,49.78 13.11,49.43 13.11,47.59 R4.1
N$18
  Top 0.203: U2.18 12.39,49.28 12.5,49.17 12.5,46.16 R5.1
N$19
  Top 0.203: U6.29 7.14,14.61 6.71,15.04 6.71,15.44 6.3,15.85 5.95,15.85 C12.1
N$20
  Top 0.203: L1.P$1 39.37,12.34 39.12,12.6 39.12,14.07 39.01,13.97 39.01,13.31 39.44,13.73 U1.46
N$21  (via drill 0.3)
  Top 0.203: R10.1 58.78,41.91 v58.52,42.16 | 59.13,26.11 59.33,25.91 | U1.75 59.44,25.81 59.33,25.91 | v58.42,25.91 59.33,25.91
  Bottom 0.203: v58.52,42.16 58.52,41.76 59.23,41.05 59.23,39.42 58.62,38.81 58.62,31.8 59.13,31.29 59.13,26.62 v58.42,25.91
N$22
  Top 0.203: U1.47 40.44,14.94 40.84,14.53 40.84,10.41 40.28,9.86 38.35,9.86 38.15,9.65 38.15,7.67 J4.SQ
N$23
  Top 0.203: D1.A 1.87,26.32 R7.2
N$24
  Top 0.203: R10.2 64.36,41.91 64.82,41.45 64.8,41.45 D2.NOLINE
N$25
  cutout Route2: 0,21.59 3.81,17.78 3.81,0.25 0.13,0.25
  cutout Route15: 0,21.59 3.81,17.78 3.81,0.25 0.13,0.25
N$26
  Top 0.305: J9.+ 24.79,2.44 25.7,3.35 25.7,4.55 Q2.2
N$27
  cutout Route2: 62.99,37.59 65.28,39.88 66.55,39.88 68.58,37.85 68.71,21.97 61.21,21.97 61.21,35.69
  cutout Route15: 62.99,37.59 65.28,39.88 66.55,39.88 68.58,37.85 68.71,21.97 61.21,21.97 61.21,35.69
N$28
  cutout Top: 13.31,23.27 16.76,23.27 16.76,20.73 13.31,20.73
N$29
  cutout Top: 34.04,31.29 58.83,31.29 58.83,16.36 34.04,16.36
N$32
  cutout Top: 8.33,4.27 11.68,4.27 11.68,1.83 8.33,1.83
P2  (via drill 0.3)
  Top 0.203: U1.64 57.4,15.91 57.4,18.69 56.9,19.2 55.68,19.2 55.37,19.51 55.37,25.3 55.88,25.81 56.9,25.81 v57,25.91
  Bottom 0.203: v57,25.91 56.9,31.9 57.71,32.72 57.71,42.57 58.42,43.28 IOL.3
P3  (via drill 0.3)
  Top 0.203: U1.60 53.44,15.95 53.54,16.05 53.54,28.14 v54.05,28.65
  Bottom 0.203: IOL.4 55.88,43.18 53.54,40.84 53.54,29.16 v54.05,28.65
P4  (via drill 0.3)
  Top 0.203: v52.93,28.65 52.93,18.29 52.43,17.78 52.43,15.89 U1.59
  Bottom 0.203: IOL.5 53.34,41.35 53.14,41.15 53.14,28.85 v52.93,28.65
P5  (via drill 0.3)
  Top 0.203: v52.22,29.67 54.15,29.67 54.76,29.06 54.76,28.14 54.25,27.64 54.25,16.06 U1.61
  Bottom 0.203: IOL.6 50.8,42.98 52.73,41.05 52.73,30.18 v52.22,29.67
P6  (via drill 0.3)
  Top 0.203: v51.21,30.48 54.15,30.48 55.17,29.46 55.17,27.74 54.76,27.33 54.76,19.1 55.37,18.49 55.37,15.94 U1.62
  Bottom 0.203: IOL.7 48.26,44.81 52.32,40.74 52.32,31.6 v51.21,30.48
P7  (via drill 0.3)
  Top 0.203: IOL.8 45.72,48.36 46.63,47.45 56.9,47.45 v57.2,47.14 | U1.66 59.43,16.87 59.23,16.87 58.42,17.68 58.42,18.49 57.1,19.81 56.39,19.81 55.98,20.22 55.98,24.69 56.39,25.1 57.3,25.1 57.71,25.5 57.71,26.92 57.2,27.43 56.29,27.43 v55.57,26.72
  Bottom 0.203: v55.57,26.72 55.68,26.52 55.68,28.14 53.95,29.87 53.95,40.64 57.2,43.89 v57.2,47.14
P07
  Top 0.203: U6.11 14.48,15.8 14.88,16.2 15.9,16.2 16.36,16.66 16.36,18.64 15.85,19.15 14.99,19.15 14.68,19.46 J6.3
P8  (via drill 0.3)
  Top 0.203: IOH.1 41.66,49.99 44.7,46.94 54.56,46.94 54.97,46.53 54.97,42.16 v56.08,41.05 | v56.49,18.08 56.49,15.93 U1.63
  Bottom 0.203: v56.08,41.05 56.49,41.05 57.3,40.23 57.3,33.22 56.29,32.21 56.29,18.49 56.49,18.29 v56.49,18.08
P08
  Top 0.203: J6.1 14.28,20.02 14.07,19.81 13.87,19.81 13.51,19.46 13.51,18.19 12.8,17.47 U6.14
P09
  Top 0.203: J6.10 15.88,22.28 15.09,21.49 13.61,21.49 13.11,20.98 13.11,18.39 12.4,17.68 U6.15
P10
  Top 0.203: J6.8 15.48,22.49 14.88,21.89 13.11,21.89 12.7,21.49 12.7,18.59 12,17.89 U6.16
P11
  Top 0.203: J6.6 15.08,22.7 14.68,22.3 12.9,22.3 12.29,21.69 12.29,18.8 11.6,18.1 U6.17
P24
  Top 0.203: U6.43 11.2,9.53 11.89,8.84 11.89,7.37 11.02,6.5 9.6,6.5 9.2,6.1 J7.2
P25
  Top 0.203: U6.44 11.6,9.69 12.29,8.99 12.29,7.11 11.28,6.1 9.86,6.1 9.6,5.84 J7.4
PCD0  (via drill 0.3)
  Top 0.203: U1.55 48.36,15.95 48.36,22.15 45.92,24.59 v45.92,25.6
  Bottom 0.203: v45.92,25.6 46.02,25.6 45.92,25.71 45.92,26.01 42.27,29.67 42.27,39.42 42.06,39.62 41.05,39.62 40.64,40.03 40.64,40.64 39.42,41.86 38.81,41.86 37.49,43.18 J3.7
PCD1  (via drill 0.3)
  Top 0.203: 47.55,15.99 47.51,15.95 | 47.51,15.95 U1.54 | 47.51,15.95 47.55,15.95 47.45,16.05 47.45,22.05 45.11,24.38 v45.11,24.99
  Bottom 0.203: v45.11,24.99 45.11,26.21 41.86,29.46 41.86,38.2 40.23,39.83 39.83,39.83 39.62,39.62 38.61,39.62 38,40.23 38,41.66 37.59,42.06 36.17,42.06 35.56,42.67 35.56,44.09 35.05,44.6 34.54,44.6 34.04,44.1 J3.9
PCD2  (via drill 0.3)
  Top 0.203: v26.62,45.31 27.43,44.5 31.29,44.5 31.49,44.3 J3.11 | 46.33,15.95 46.38,15.9 | 46.38,15.9 46.43,15.85 U1.53 | 46.38,15.9 46.43,15.95 46.43,22.45 44.3,24.59 v44.3,25.6
  Bottom 0.203: v26.62,45.31 26.62,44.6 27.43,43.79 27.43,39.32 28.45,38.3 30.17,38.3 30.89,37.59 30.89,31.09 30.28,30.48 30.28,28.25 31.5,27.03 31.5,25.5 31.9,25.1 35.97,25.1 38.51,27.64 42.98,27.64 44.3,26.31 v44.3,25.6
PCD3  (via drill 0.3)
  Top 0.203: v25.3,45.21 26.01,44.5 26.72,44.5 27.13,44.09 27.74,44.09 28.65,43.18 J3.13 | U1.52 45.41,15.9 45.41,22.45 43.48,24.38 v43.48,24.99
  Bottom 0.203: v25.3,45.21 25.2,45.11 25.2,42.98 25.6,42.57 25.6,41.25 25.3,40.95 25.3,40.23 26.11,39.42 26.72,39.42 28.24,37.9 29.97,37.9 30.48,37.39 30.48,31.29 29.87,30.68 29.87,28.04 31.09,26.82 31.09,25.3 31.7,24.69 36.17,24.69 38.71,27.23 42.27,27.23 43.48,26.01 v43.48,24.99
PCD4  (via drill 0.3)
  Top 0.203: v24.79,41.86 26.01,43.18 J3.15 | 44.3,16.05 44.35,16 | 44.35,16 44.5,15.85 44.46,15.85 U1.51 | 44.35,16 44.4,16.05 44.4,22.86 42.67,24.59 v42.67,25.6
  Bottom 0.203: v24.79,41.86 24.89,41.76 24.89,40.03 25.91,39.01 26.52,39.01 28.04,37.49 29.67,37.49 30.07,37.08 30.07,31.5 29.46,30.89 29.46,27.84 30.68,26.62 30.68,25.1 31.5,24.28 36.37,24.28 38.91,26.82 41.96,26.82 42.67,26.11 v42.67,25.6
PCD5  (via drill 0.3)
  Top 0.203: 43.41,15.85 43.48,15.85 43.38,15.95 43.38,23.27 41.86,24.79 v41.86,24.99 | 43.38,15.85 43.41,15.85 | 43.41,15.85 U1.50
  Bottom 0.203: v41.86,24.99 41.86,25.91 41.35,26.42 39.12,26.42 36.58,23.88 31.29,23.88 30.28,24.89 30.28,26.42 29.06,27.64 29.06,31.09 29.67,31.7 29.67,36.78 29.36,37.08 27.84,37.08 26.31,38.61 24.49,38.61 22.86,40.23 22.86,41.96 23.87,42.98 J3.17
PCD6  (via drill 0.3)
  Top 0.203: U1.49 42.47,15.91 42.47,23.27 41.05,24.69 v41.05,25.6
  Bottom 0.203: v41.05,25.6 40.95,25.6 40.64,25.91 39.22,25.91 36.78,23.47 31.09,23.47 29.87,24.69 29.87,26.21 28.65,27.43 28.65,31.29 29.26,31.9 29.26,36.27 28.85,36.68 27.63,36.68 26.11,38.2 24.28,38.2 22.45,40.03 22.45,41.96 21.33,43.08 J3.19
PCD7  (via drill 0.3)
  Top 0.203: U1.48 41.45,15.89 41.45,23.27 40.23,24.49 v40.23,24.99
  Bottom 0.203: v40.23,24.99 38.91,24.99 36.98,23.06 30.89,23.06 29.46,24.49 29.46,26.01 28.24,27.23 28.24,31.5 28.85,32.11 28.85,35.87 28.45,36.27 27.43,36.27 25.91,37.8 22.35,37.8 20.12,40.03 20.12,42.06 19,43.18 J3.21
PCEN1  (via drill 0.3)
  Top 0.203: U1.57 50.39,15.92 50.39,21.34 v46.74,24.99
  Bottom 0.203: v46.74,24.99 46.74,25.81 42.67,29.87 42.67,41.66 42.27,42.06 39.83,42.06 39.11,42.78 J3.5
PCLK  (via drill 0.3)
  Top 0.203: U1.58 51.41,15.9 51.41,20.93 47.55,24.79 v47.55,25.6
  Bottom 0.203: v47.55,25.6 43.08,30.07 43.08,41.86 41.76,43.18 J3.3
PRI_RX  (via drill 0.3)
  Top 0.203: U1.21 38.41,31.91 38.41,32.82 36.07,32.82 35.87,33.02 35.87,33.43 35.15,34.14 32,34.14 29.87,32.11 19,32.11 19,32.82 18.39,33.43 17.6,33.43 U4.2 17.48,33.53 16.87,33.53 15.8,34.6 v15.8,36.02
  Bottom 0.203: IOL.1 62.74,50.8 61.37,52.17 18.39,52.17 17.63,51.41 17.63,45.62 14.12,42.11 14.12,37.69 v15.8,36.02
PRI_TX  (via drill 0.3)
  Top 0.203: U4.4 18.16,34.77 18.59,34.34 18.59,33.83 19.91,32.51 29.67,32.51 31.7,34.54 36.78,34.54 v37.39,33.93 | v37.39,30.68 37.39,31.83 U1.22 | IOL.2 60.76,50.8 59.33,52.22 35.76,52.22 35.36,51.82 35.36,42.32 v35.13,42.09
  Bottom 0.203: v37.39,30.68 v37.39,33.93 35.13,36.2 v35.13,42.09
PWM0
  Top 0.203: J3.16 26.42,36.78 27.03,36.17 48.77,36.17 51.41,33.53 51.41,32.31 51.44,32.28 U1.8
PWM1
  Top 0.203: U1.9 50.44,32.27 50.39,32.31 50.39,33.53 48.16,35.76 24.79,35.76 23.98,36.58 23.98,40.54 J3.18
PWM2
  Top 0.203: J3.20 21.34,36.98 22.96,35.36 47.55,35.36 49.38,33.53 49.38,32.31 49.44,32.25 U1.10
PWM3
  Top 0.203: U1.11 48.44,32.23 48.36,32.31 48.36,33.53 46.94,34.95 22.76,34.95 18.9,38.81 18.9,40.54 J3.22
RST  (via drill 0.3)
  Top 0.203: U4.10 14.36,35.42 14.68,35.1 14.68,32.87 16.31,31.24 30.38,31.24 32.36,33.22 33.63,33.22 v33.63,32.92 | J8.3 58.22,36.02 v59.38,34.85 | v61.26,34.85 61.26,35.31 62.48,36.53 62.48,39.98 61.32,41.15 57.2,41.15 56.08,40.03 v49.58,40.03 | v43.79,34.24 40.69,34.24 v39.42,32.97 39.42,31.89 U1.20 39.37,31.8 v39.37,23.11 | v31.8,8.94 R6.2 32.72,8.88 32.72,8.33 32.66,8.33 32.26,7.92 32.26,3.3 POWER.3
  Bottom 0.203: 39.37,33.02 v39.42,32.97 39.42,31.7 37.69,29.97 36.88,29.97 35.66,31.19 34.44,31.19 33.63,32 v33.63,32.92 | v61.26,34.85 v59.38,34.85 | v43.79,34.24 v49.58,40.03 | v31.8,8.94 31.8,12.7 32.31,13.21 32.31,16.05 v39.37,23.11
SCL  (via drill 0.3)
  Top 0.203: v10.77,8.23 10.77,8.74 10.36,9.14 10.36,9.75 10,10.12 U6.40 | U5.P4 30.95,10.71 v30.99,10.67 | U7.5 29.57,17.58 29.87,17.27 v30.99,17.27 31.6,17.88 U1.39 | R11.2 16.56,6.5 v16.36,6.3 | U8.B3 27.84,15.6 28.19,15.95 30.07,15.95 v31.5,14.53
  Bottom 0.203: v10.77,8.23 10.57,8.23 9.96,7.62 9.96,6.91 10.36,6.5 11.38,6.5 12.09,7.21 16.36,7.21 | v16.36,6.3 16.36,7.21 | 30.99,14.53 v30.99,10.67 30.99,8.23 29.77,7.01 16.56,7.01 16.36,7.21 | 30.99,14.53 v30.99,17.27 | v31.5,14.53 30.99,14.53
SDA  (via drill 0.3)
  Top 0.203: v10.72,7.21 10.82,7.32 11.12,7.32 11.48,7.67 11.48,8.58 10.77,9.3 10.77,9.91 10.4,10.28 U6.41 | U5.P6 28.08,12.34 28.35,12.6 29.97,12.6 v30.17,12.8 | U7.6 30.17,18.08 v30.28,18.19 | R12.2 16.56,8.53 v16.36,8.33 | v32.11,17.07 33.24,17.07 U1.40 | U8.C3 29.78,14.62 29.78,14.47 v30.02,14.22
  Bottom 0.203: v10.72,7.21 11.18,7.21 11.58,7.62 16.36,7.62 | v16.36,8.33 16.36,7.62 | 30.17,14.22 v30.17,12.8 30.17,8.23 29.36,7.42 16.97,7.42 16.76,7.62 16.36,7.62 | 30.17,14.22 30.17,18.08 v30.28,18.19 30.48,18.19 30.79,18.49 31.39,18.49 32.11,17.78 v32.11,17.07 | v30.02,14.22 30.17,14.22
SENS_VCC  (via drill 0.3)
  Top 0.203: C18.2 23.05,8.75 v23.27,8.53 23.77,8.03 27.03,8.03 | C5.2 23.08,13.19 v23.37,12.9 | U5.P14 27.08,8.09 27.03,8.03 | U5.P1 28.86,8.23 28.65,8.03 27.03,8.03 | v24.18,17.07 24.14,17.11 C14.2 24.14,18.55 24.79,19.2 25.91,19.2 26.52,18.59 26.52,18.29 26.72,18.08 U7.1 | U8.A3 27.34,15.59 27.28,15.65 v27.03,15.65
  Top 0.305: Q3.3 25.08,22.64 v24.89,22.45
  Bottom 0.203: v23.27,8.53 23.88,8.53 23.98,8.43 | v23.37,12.9 23.98,12.9 | v24.18,17.07 23.98,17.07 | v27.03,15.65 23.98,15.65
  Bottom 0.305: v24.89,22.45 23.98,21.54 23.98,17.07 23.98,15.65 23.98,12.9 23.98,8.43 23.98,7.92
SPI_CLK
  Top 0.203: U1.3 56.44,32.16 56.29,32.31 56.29,32.72 51.21,37.8 36.98,37.8 36.58,38.2 J3.8
SPI_CS1
  Top 0.203: U1.2 57.44,32.18 57.3,32.31 57.3,32.72 51.82,38.2 39.22,38.2 39.01,38.41 39.01,40.54 39.02,40.54 J3.6
SPI_CS2
  Top 0.203: U1.1 58.44,32.6 52.43,38.61 42.06,38.61 41.66,39.01 J3.4
SPI_MISO
  Top 0.203: U1.4 55.44,32.27 55.47,32.31 55.47,32.72 50.8,37.39 34.54,37.39 34.14,37.8 34.14,40.54 J3.10
SPI_MOSI
  Top 0.203: U1.5 54.44,32.29 54.46,32.31 54.46,32.72 50.19,36.98 32.11,36.98 31.7,37.39 31.7,40.43 31.62,40.51 J3.12
STORM_CLK  (via drill 0.3)
  Top 0.203: U6.22 9.6,18.49 9.96,18.85 9.96,20.47 v9.91,20.52 | v20.52,16.46 23.27,19.2 23.27,22.86 25.09,24.69 29.46,24.69 31.7,22.45 31.7,21.54 32.31,20.93 33.33,20.93 33.43,20.83 33.43,20.87 U1.36
  Bottom 0.203: v9.91,20.52 9.96,20.47 9.96,18.85 9.6,18.49 9.6,16.31 10.57,15.34 19.41,15.34 v20.52,16.46
STORM_CTS  (via drill 0.3)
  Top 0.203: U6.25 7.77,16.2 7.52,16.46 v7.52,17.22 | U1.34 33.42,22.86 32.72,22.86 30.07,25.5 24.69,25.5 22.05,22.86 22.05,22.25 21.54,21.74 v21.54,21.13
  Bottom 0.203: v7.52,17.22 7.52,15.85 8.43,14.93 20.32,14.93 21.54,16.15 v21.54,21.13
STORM_INT  (via drill 0.3)
  Top 0.203: U6.27 7.35,15.4 5.94,16.81 v5.44,16.81 | v57.66,20.32 59.18,21.84 59.44,21.84 U1.71 | v56.49,12.39 56.29,12.6 51.21,12.6 49.48,14.33 42.16,14.33 41.76,13.92 41.76,9.96 40.74,8.94 40.08,8.94 39.57,8.43 39.57,6.4 39.17,5.99 37.03,5.99 35.81,7.21 v33.73,7.21
  Bottom 0.203: v5.44,16.81 5.49,16.61 7.98,14.12 8.59,14.12 8.59,14.07 6.4,11.89 6.4,9.6 10.41,5.59 19.91,5.59 20.88,6.55 24.64,6.55 25.6,5.59 28.91,5.59 30.53,7.21 v33.73,7.21 | v57.66,20.32 57.66,13.56 v56.49,12.39
STORM_RTS  (via drill 0.3)
  Top 0.203: U6.26 7.56,15.8 6.91,16.46 6.91,16.81 6.5,17.22 v6.5,17.37 | v22.55,20.42 22.55,22.76 24.89,25.1 29.77,25.1 32.31,22.55 32.31,22.25 32.61,21.95 33.37,21.95 U1.35
  Bottom 0.203: v6.5,17.37 6.5,16.26 8.23,14.53 20.62,14.53 22.05,15.95 22.05,19.91 v22.55,20.42
STORM_RX  (via drill 0.3)
  Top 0.203: U6.21 10,18.23 10.67,18.9 v10.67,19.51 | v20.83,22.66 20.83,22.86 24.28,26.31 30.79,26.31 32.21,24.89 33.45,24.89 | 33.53,24.89 33.45,24.89 | 33.45,24.89 U1.32
  Bottom 0.203: v10.67,19.51 10.67,18.9 10.01,18.24 10.01,16.46 10.72,15.75 18.69,15.75 20.83,17.88 v20.83,22.66
STORM_TX  (via drill 0.3)
  Top 0.203: U6.20 10.4,18.07 11.48,19.15 11.48,20.27 v11.18,20.57 | v20.12,18.29 20.12,20.93 21.64,22.45 21.64,23.06 24.49,25.91 30.58,25.91 32.51,23.98 33.34,23.98 U1.33
  Bottom 0.203: v11.18,20.57 11.48,20.27 11.48,19.15 10.41,18.08 10.41,16.61 10.87,16.15 17.98,16.15 v20.12,18.29
SW_EN  (via drill 0.3)
  Top 0.203: U4.12 13.34,34.12 v13.56,34.34 13.56,33.48 13.56,33.47 U4.13 | v21.23,34.54 19.92,34.54 R9.2 19.77,34.7 19.05,34.7 18.69,35.05 | U4.5 18.32,35.42 18.69,35.05 | U4.6 18.69,36.07 18.69,35.05
  Bottom 0.203: v13.56,34.34 21.03,34.34 v21.23,34.54 21.23,28.98 J2.R
SWCLK  (via drill 0.3)
  Top 0.203: v58.22,30.79 59.03,29.97 59.44,29.97 U1.79 | J8.4 58.22,40.13 v58.52,40.44
  Bottom 0.203: v58.52,40.44 58.52,39.62 58.22,39.32 v58.22,30.79
SWD
  Top 0.203: U1.80 60.34,30.88 60.45,30.99 60.45,31.19 54.36,37.29 54.36,38.81 55.17,39.62 56.29,39.62 56.9,39.01 J8.2
SWDCLK  (via drill 0.3)
  Top 0.203: J6.2 14.28,24.18 14.12,24.33 13.26,24.33 12.85,23.93 12.85,23.47 12.5,23.11 10.16,23.11 8.64,21.59 | U6.24 8.8,17.82 8.08,18.54 8.08,18.99 8.05,19.02 | 8.05,19.02 R8.1 | 8.05,19.02 8.13,19.1 8.23,19.1 8.64,19.51 8.64,21.59 | J23.4 3.47,21.72 v3.45,21.74 | 8.64,21.59 8.59,21.59 8.03,22.15 v7.77,22.15
  Bottom 0.203: v3.45,21.74 5.03,21.74 5.44,22.15 v7.77,22.15
SWDIO  (via drill 0.3)
  Top 0.203: J6.4 14.68,22.86 14.53,22.71 10.31,22.71 9.14,21.54 9.14,19.15 v9.2,19.1 9.2,18.84 U6.23 | v4.06,17.88 3.25,18.69 3.25,19.51 4.06,20.32 4.47,20.32 J23.2
  Bottom 0.203: 4.07,17.88 v4.06,17.88 4.52,18.34 7.57,18.34 8.23,19 9.09,19 v9.2,19.1
SWO
  Top 0.203: J8.6 59.44,39.01 59.44,39.83 60.25,40.64 61.26,40.64 62.08,39.83 62.08,36.68 60.05,34.65 60.05,32.21 60.86,31.39 60.86,30.79 60.45,30.38 60.45,28.14 60.25,27.94 59.44,27.94 U1.77
TMP_DRDY  (via drill 0.3)
  Top 0.203: U1.72 59,22.88 58.67,22.55 v57.76,22.55 | v56.54,11.18 51.87,11.18 49.23,13.82 42.93,13.82 v42.52,13.41 | v32.97,12.7 31.65,12.7 30.84,13.51 29.41,13.51 28.8,14.12 U8.C2
  Bottom 0.203: v57.76,22.55 57.96,22.55 57.96,22.15 58.37,21.74 58.37,13 v56.54,11.18 | v42.52,13.41 33.68,13.41 v32.97,12.7
U1_CLK  (via drill 0.3)
  Top 0.203: v32.26,25.96 33.35,25.96 U1.31
  Bottom 0.203: IOH.6 28.96,48.67 27.84,47.55 27.84,39.62 28.65,38.81 30.28,38.81 31.29,37.8 31.29,30.89 30.68,30.28 30.68,28.5 32.26,26.92 v32.26,25.96
U1_CTS  (via drill 0.3, 0.6)
  Top 0.203: v32.51,27.84 33.4,27.84 U1.29 | v36.58,47.37 39.12,49.91 IOH.2
  Bottom 0.203: v32.51,27.84 32.51,43.89 34.14,45.52 36.17,45.52 36.58,45.92 v36.58,47.37
U1_RTS  (via drill 0.3)
  Top 0.203: v34.44,26.92 33.48,26.92 U1.30
  Bottom 0.203: v34.44,26.92 32.92,28.45 32.92,43.69 34.34,45.11 36.6,45.11 37.85,46.36 37.85,48.13 36.96,49.02 36.96,50.42 IOH.3
U1_RX  (via drill 0.3)
  Top 0.203: v31.39,29.87 U1.27
  Bottom 0.203: IOH.5 31.5,47.55 30.07,46.13 30.07,39.62 31.7,38 31.7,30.07 v31.39,29.87
U1_TX  (via drill 0.3)
  Top 0.203: v31.7,28.85 33.41,28.85 U1.28
  Bottom 0.203: IOH.4 34.04,48.06 32.92,46.94 31.5,46.94 30.48,45.92 30.48,39.83 32.11,38.2 32.11,29.26 v31.7,28.85
USB_3V3  (via drill 0.3)
  Top 0.203: 6.2,39.23 C2.2 | C2.2 6.5,38.93 6.5,34.9 7.11,34.29 U3.2 9.91,34.29 10.87,33.33 10.87,31.6 11.68,30.79 13.41,30.79 13.72,30.48 13.72,29.92 13.97,29.67 | C2.2 6.11,40.37 5.39,41.1 5.39,44.81 6.71,46.13 8.14,46.13 | 8.14,46.13 8.53,46.13 8.64,46.23 | U2.12 8.64,46.24 8.64,46.23 | U2.11 8.14,46.13 | U2.20 12.02,50.28 v12.5,50.75 | v8.64,45.52 8.64,46.23 | Q1.2 13.97,29.67 | 13.97,29.67 17.27,29.67 17.98,28.96 J2.SQ
  Bottom 0.203: v12.5,50.75 9.3,47.55 9.3,46.18 v8.64,45.52
V+  (via drill 0.3)
  Top 0.203: J1.1VBUS 5.14,49.18 v5.59,49.63 | v6.3,44.04 7.46,44.04 C1.2 | R1.1 9.41,28.79 9.45,28.75 | 9.45,28.75 10.87,27.33 13.53,27.33 Q1.1 | v9.45,29.77 9.45,28.75 | J7.5 10,2.28 10.26,2.54 | J7.7 10.4,2.4 10.26,2.54 | 10.26,2.54 9.86,2.95 6.1,2.95 v5.69,2.54
  Top 0.254: C1.2 7.56,37.25 8.33,36.47 8.33,36.58 U3.3
  Top 0.406: J10.2 POWER.8
  Bottom 0.203: v6.3,44.04 6.4,44.15 1.58,44.15 1.52,44.2 | v9.45,29.77 8.94,30.28 1.52,30.28 | v5.69,2.54 5.69,1.02
  Bottom 0.406: v5.59,49.63 2.59,49.63 1.52,48.57 1.52,44.2 1.52,30.28 1.52,19.3 3.96,16.87 3.96,1.02 5.69,1.02 9.14,1.02 12.8,4.67 15.14,4.67 16.66,3.15 16.66,1.42 17.07,1.02 38.1,1.02 | 38.1,1.02 44.91,1.02 45.72,1.83 POWER.8 | POWER.5 38.1,1.02
VCCINT  (via drill 0.3)
  Top 0.203: U6.12 14.12,16.2 v14.88,16.97 | J23.1 5.88,20.03 v6.6,19.3 | C7.1 15.08,17.98 v15.6,18.39 | U6.1 14.81,11.8 15.24,11.38 C6.1 15.62,10.64 v15.75,10.52 16.71,9.55 18.19,9.55 18.53,9.2 18.53,8.43 | U1.44 37.44,16.96 v37.64,17.17 | Q1.3 11.73,28.81 11.07,29.46 v11.07,29.87 | J7.1 9.2,2.18 8.94,2.44 | 8.94,2.44 7.72,2.44 v7.21,1.93 | J7.3 9.6,2.29 9.45,2.44 8.94,2.44 | Q3.2 29.09,19.47 v29.36,19.2 | J8.1 56.95,37.34 v56.29,36.68 | R6.1 v35.26,8.94 | U4.14 11.91,32.39 v12.5,31.8 | R11.1 18.53,8.43 | 18.53,8.43 R12.1 | R14.1 R13.1 22.7,46.9 v22.76,46.84 | R14.1 21.4,46.9 21.44,46.94 21.38,46.94 R14.1 | J10.1 43.18,5.94
  Top 0.305: Q2.3 26.54,6.79 v27.03,6.3
  Top 0.406: 43.18,5.94 42.52,5.28 40.89,5.28 v40.59,5.59
  pour Route15: -4.83,55.73 70.97,55.73 70.97,-3.05 -4.83,-3.05
VDD_PA
  Top 0.203: U6.30 6.88,14.2 6.66,14.43 5.93,14.43 | B2.VCC 5.93,14.43 | 5.93,14.43 C13.1

### Text on the board
Top: [410]
tPlace: 13 | 12 | 11 | 10 | 9 | 8 | 7 | 6 | 5 | 4 | 3 | 2 | 1 | 0 | FIRESTORM 1.3 | (C) 2014 UC Berkeley | MAIN | COPROC | MP ANDERSEN | 3.5V MAX
bPlace: fire.storm.rocks | http://
tNames: AR | G | TX | RX | 1 | IOREF | RST | 3V3 | 5V | GND | VIN | A0 | A1 | A2 | A3 | A4 | A5
tStop: [410]
ReferenceLC: L | TX | ON | RX | PC1 | PC2
LABELS: J3 | + | DNP | DNP | C15 | U5 | R6 | C9 | C11 | DNP
214bmp: D:/SmartProjects/Snc/a4_bn_logo2.bmp